# EasyEDA Pro project PBMCU_C_Hall.epro, board 整合板
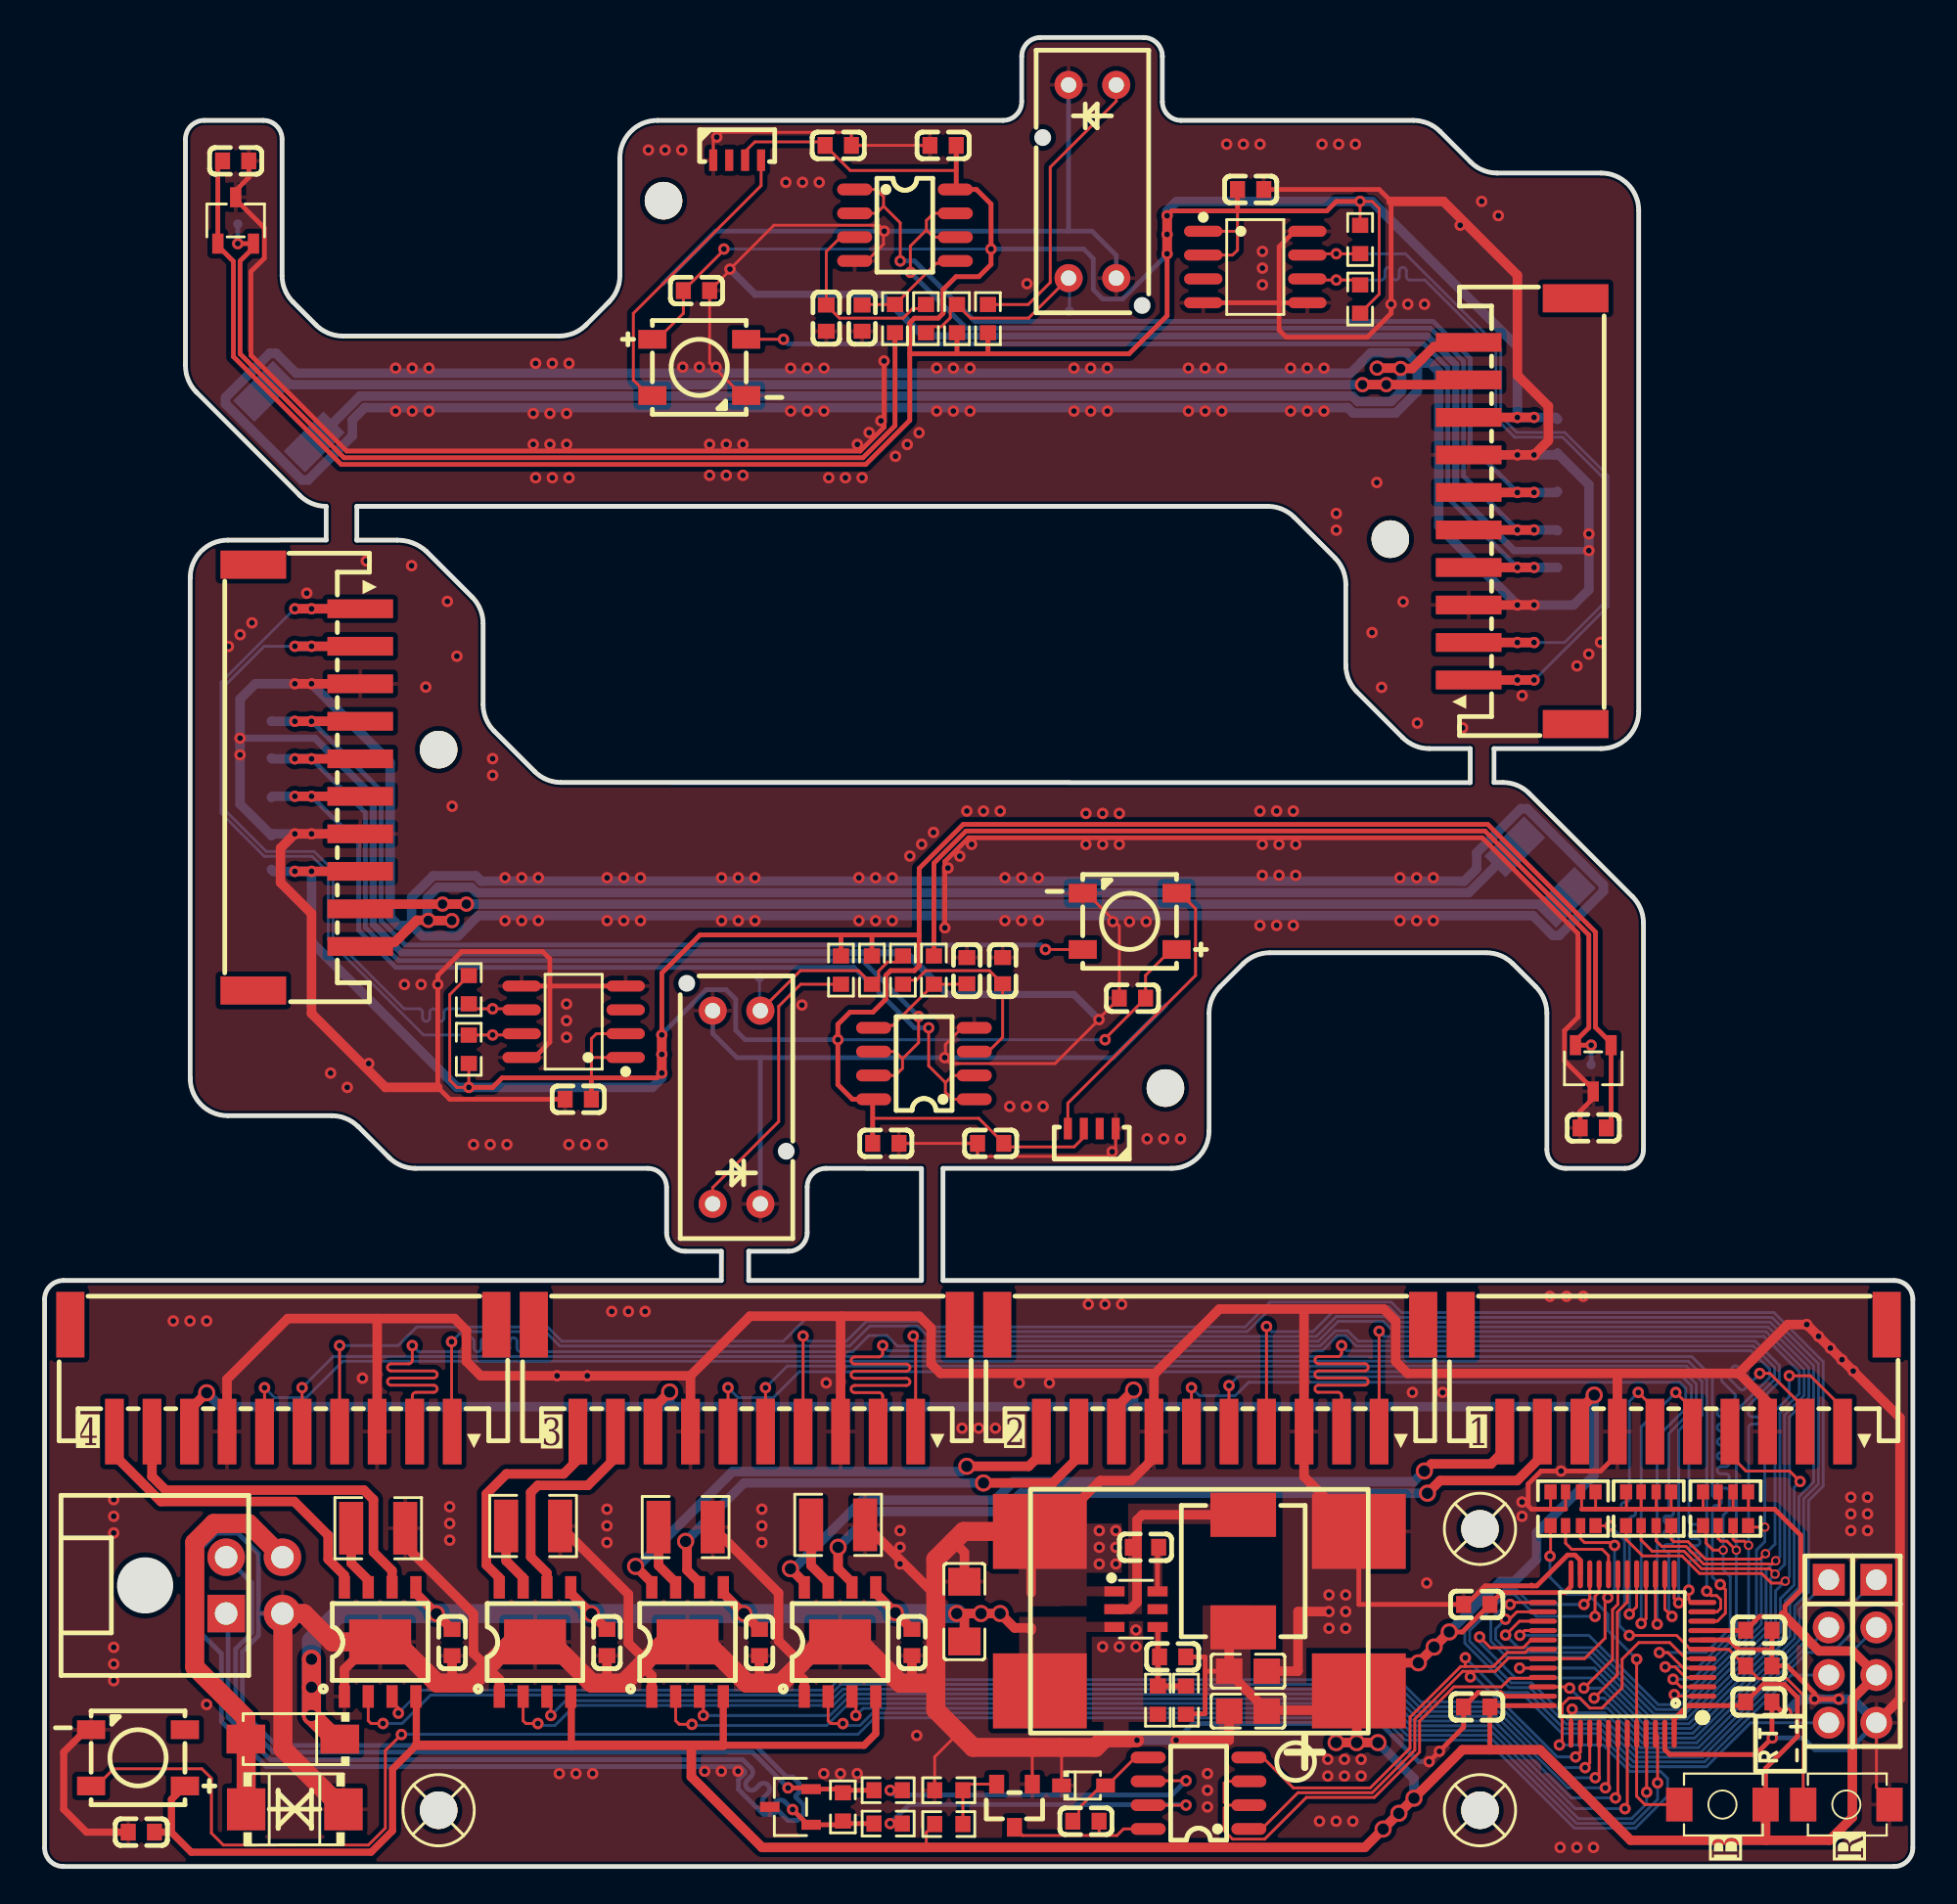
[diagram p4: board, top side]
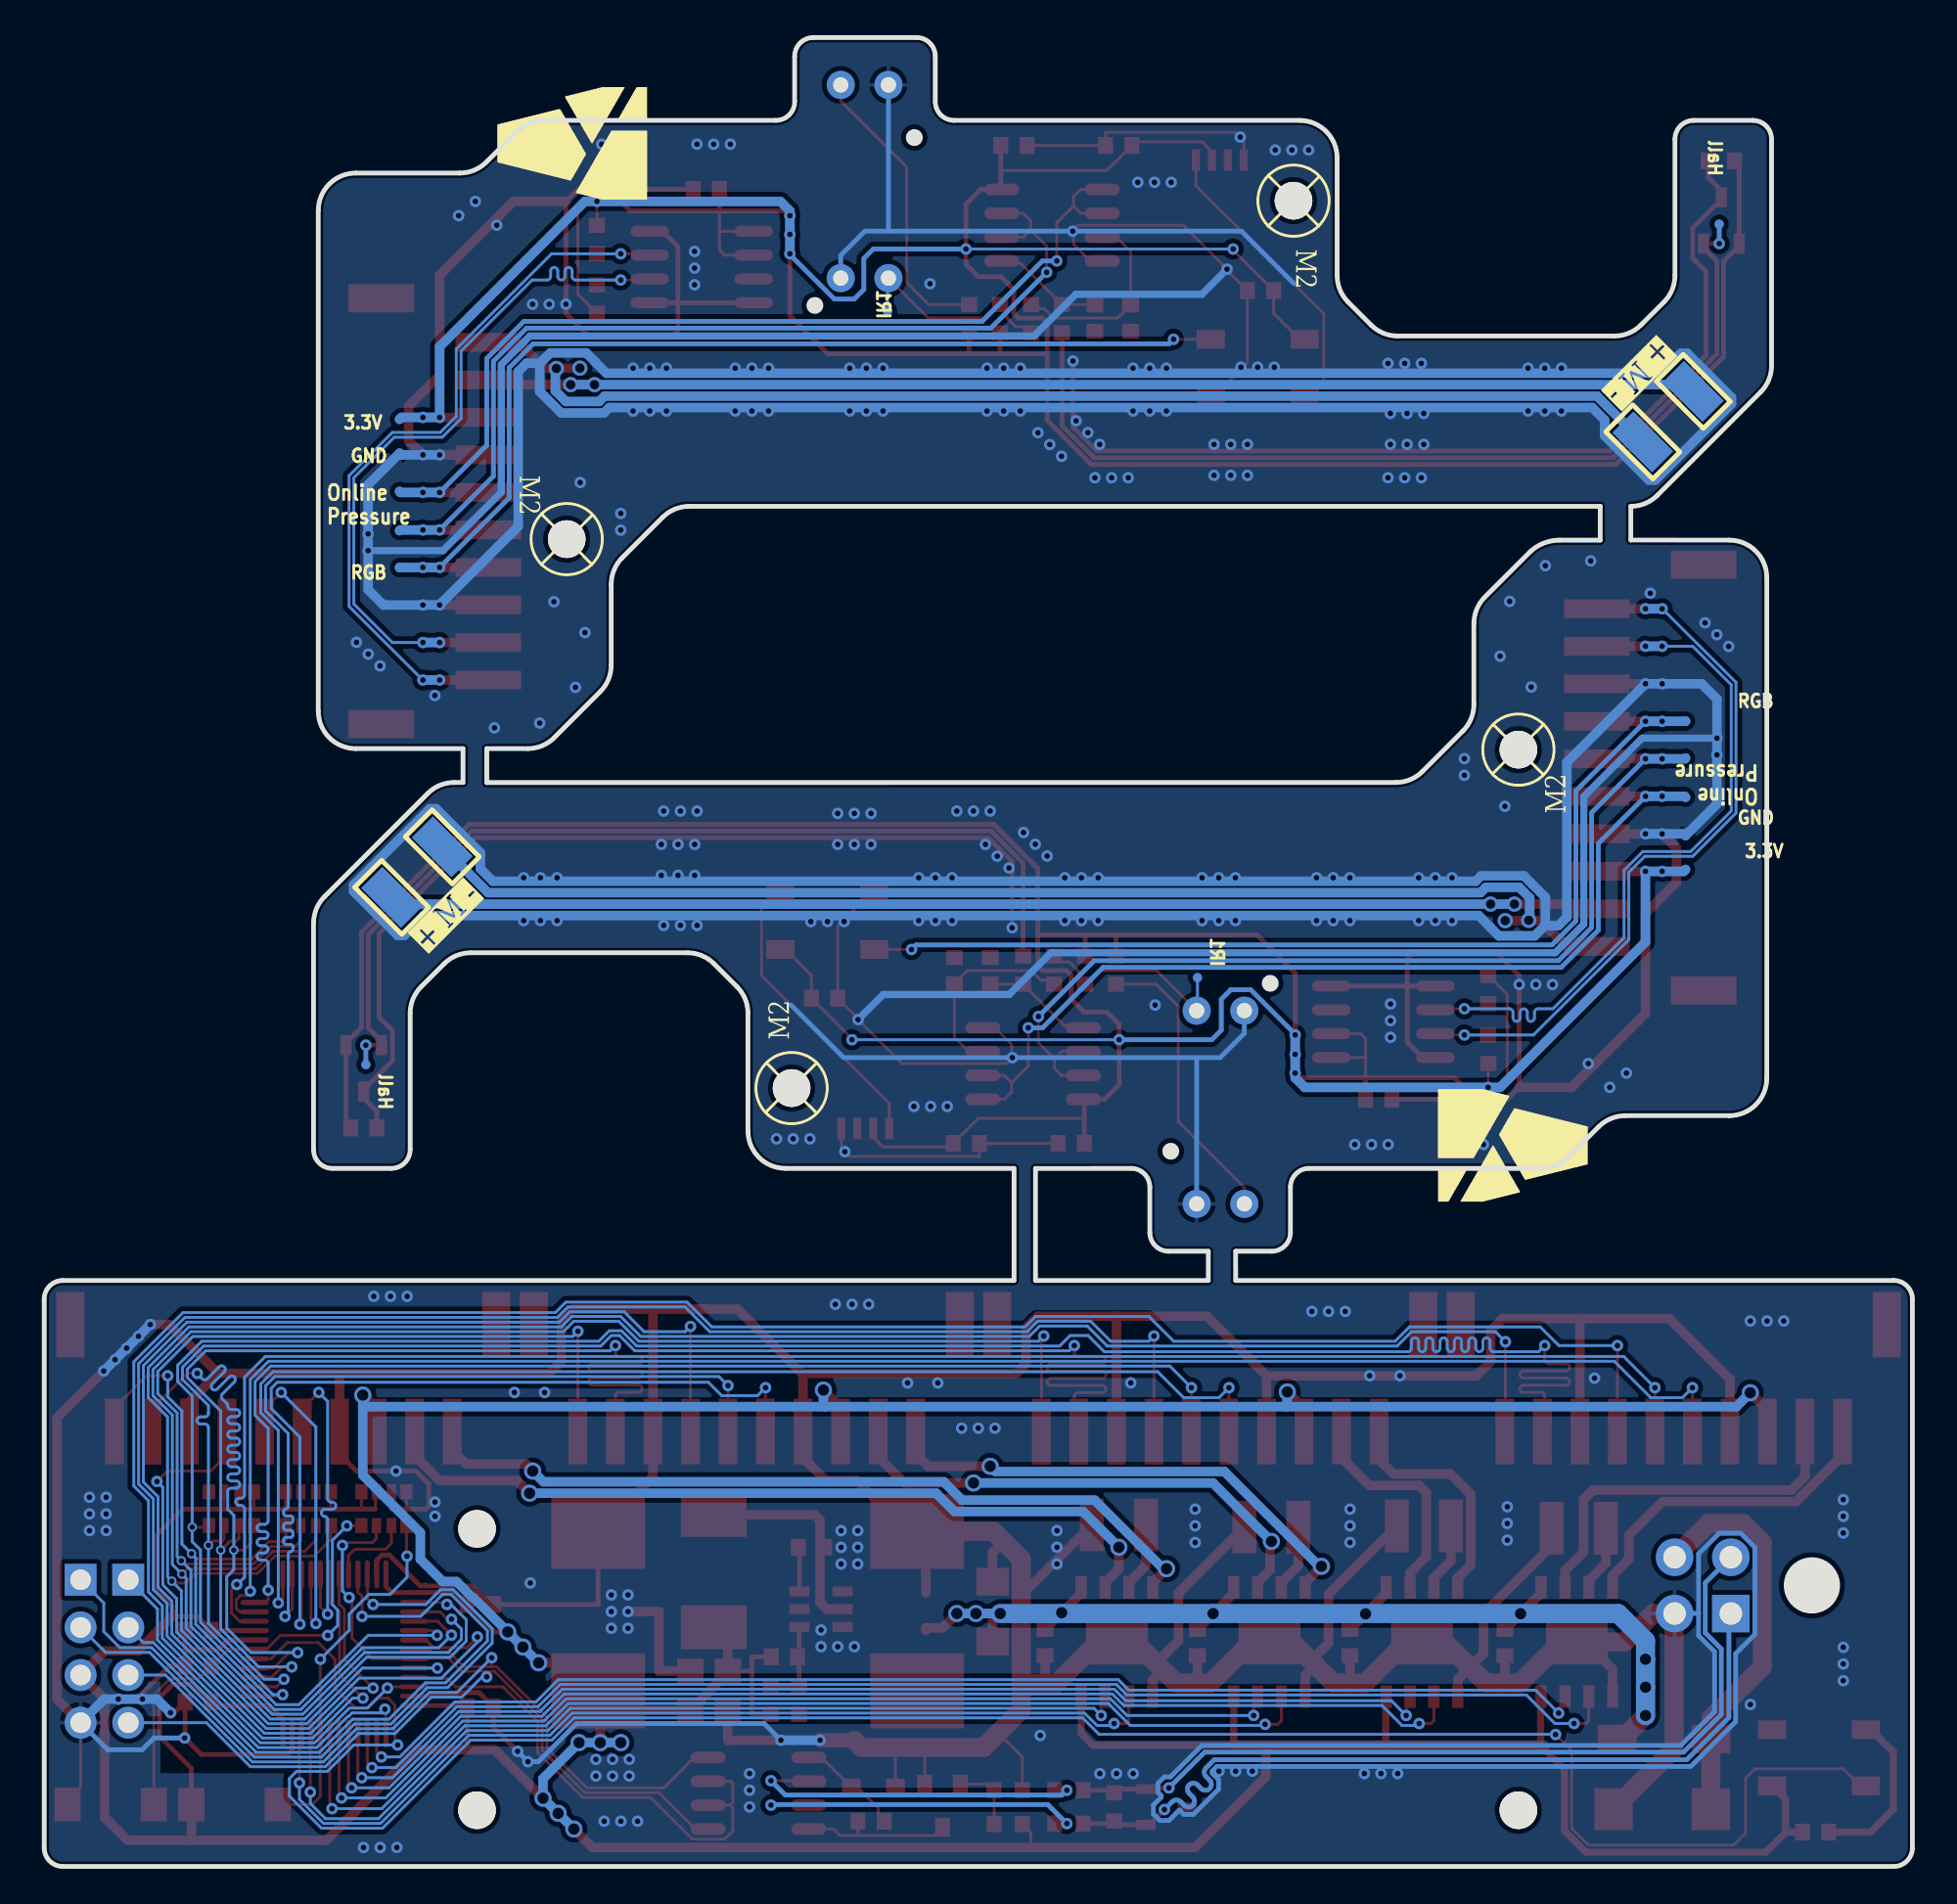
[diagram p5: board, bottom side, seen from below]

Outline 99.57 x 97.51 mm; copper layers: Top Layer, Bottom Layer. Coordinates in mm from the lower left corner of the outline.
Outline path: 0,30.24 arc(0.29,30.95) 1,31.24 36.07,31.24 36.07,32.8 34.15,32.8 arc(33.44,33.09) 33.15,33.8 33.15,36.22 arc(32.86,36.93) 32.15,37.22 19.77,37.22 arc(19,37.37) 18.35,37.8 16.72,39.44 arc(16.07,39.87) 15.3,40.03 9.76,40.03 arc(8.35,40.61) 7.76,42.03 7.76,68.71 arc(8.35,70.13) 9.76,70.71 15.01,70.72 15.01,72.51 arc(14.24,72.67) 13.59,73.1 8.09,78.6 arc(7.66,79.25) 7.51,80.02 7.51,92.09 arc(7.8,92.8) 8.51,93.09 11.66,93.09 arc(12.36,92.8) 12.66,92.09 12.66,84.82 arc(12.81,84.05) 13.24,83.4 14.47,82.18 arc(15.11,81.75) 15.88,81.59 27.44,81.59 arc(28.2,81.75) 28.85,82.18 30.07,83.4 arc(30.51,84.05) 30.66,84.82 30.66,91.09 arc(31.25,92.5) 32.66,93.09 51.08,93.09 arc(51.79,93.38) 52.08,94.09 52.08,96.51 arc(52.37,97.22) 53.08,97.51 58.57,97.51 arc(59.28,97.22) 59.57,96.51 59.57,94.09 arc(59.86,93.38) 60.57,93.09 72.95,93.09 arc(73.72,92.94) 74.37,92.5 76,90.87 arc(76.65,90.43) 77.42,90.28 82.96,90.28 arc(84.37,89.7) 84.96,88.28 84.96,61.6 arc(84.37,60.18) 82.96,59.6 77.25,59.6 77.25,57.79 77.71,57.79 arc(78.48,57.64) 79.13,57.21 84.63,51.71 arc(85.06,51.06) 85.21,50.29 85.21,38.22 arc(84.92,37.51) 84.21,37.22 81.06,37.22 arc(80.36,37.51) 80.06,38.22 80.06,45.49 arc(79.91,46.25) 79.48,46.9 78.25,48.13 arc(77.61,48.56) 76.84,48.71 65.28,48.71 arc(64.52,48.56) 63.87,48.13 62.65,46.9 arc(62.21,46.25) 62.06,45.49 62.06,39.22 arc(61.47,37.8) 60.06,37.22 47.88,37.22 47.88,31.24 98.57,31.24 arc(99.28,30.95) 99.57,30.24 99.57,1 arc(99.28,0.29) 98.57,0 1,0 arc(0.29,0.29) 0,1 0,30.24 ; 16.64,70.71 16.64,72.51 65.19,72.51 arc(65.96,72.36) 66.61,71.93 68.76,69.77 arc(69.2,69.12) 69.35,68.36 69.35,64.05 arc(69.5,63.28) 69.94,62.63 72.38,60.18 arc(73.03,59.75) 73.8,59.6 75.98,59.6 75.98,57.78 27.53,57.79 arc(26.76,57.95) 26.11,58.38 23.96,60.54 arc(23.52,61.18) 23.37,61.95 23.37,66.26 arc(23.22,67.03) 22.78,67.68 20.34,70.12 arc(19.62,70.56) 18.8,70.71 16.64,70.71 ; 37.52,32.8 39.64,32.8 arc(40.35,33.09) 40.64,33.8 40.64,36.22 arc(40.93,36.93) 41.64,37.22 46.74,37.21 46.74,31.24 37.52,31.24 37.52,32.8
Stack: Top Layer 0.035mm / Dielectric1 1.51mm FR4 er 4.5 / Bottom Layer 0.035mm

## Design rules (mm)
template: JLCPCB Capability(Two Layers Board)
spacing copperThickness1oz (default): track to track 0.102, other pairs 0.152 to 0.3
spacing copperThickness2oz: track to track 0.203, other pairs 0.152 to 0.3
track width copperThickness1oz (default): min 0.127, default 0.254, max 2.54
track width copperThickness2oz: min 0.203, default 0.254, max 2.54
differential pair differentialPair (default): width min 0.127, default 0.254, max 2.54; gap min 0.152, default 0.152
via viaSize (default): diameter min 0.5, default 0.61, max 10; hole min 0.3, default 0.305, max 6.3

## Placement (name value [footprint] x y rotation side)
3.3V  -  [Test-Point-0.5mm#2]  80.63 77.15 270 bottom
3.3V#2  -  [Test-Point-0.5mm#2]  12.09 53.15 90 bottom
C1  47pF  [C0603]  60.12 11.18 0 top
C2  22uF  [C1206]  49.02 13.59 270 top
C3  22uF  [C0805]  64.13 8.28 0 top
C4  22uF  [C0805]  64.13 10.41 180 top
C5  100nF  [C0603]  58.67 17.02 180 top
C6  -  [C0603]  64.28 89.41 180 top
C6#2  -  [C0603]  28.44 40.9 0 top
C6#3  -  [C0603]  91.36 10.69 180 top
C7  -  [C0603]  34.74 84.02 180 top
C7#2  -  [C0603]  57.98 46.29 0 top
C7#3  -  [C0603]  91.36 12.6 180 top
C8  -  [C0603]  47.89 91.76 0 top
C8#2  -  [C0603]  44.83 38.55 180 top
C8#3  -  [C0603]  91.36 8.77 180 top
C9  -  [C0603]  42.3 91.76 180 top
C9#2  -  [C0603]  50.42 38.55 0 top
C9#3  -  [C0603]  76.33 13.97 0 top
C10  -  [C0603]  10.18 90.93 180 top
C10#2  -  [C0603]  82.54 39.38 0 top
C10#3  -  [C0603]  76.33 8.51 0 top
C11  -  [C0603]  43.57 82.55 90 top
C11#2  -  [C0603]  49.15 47.76 270 top
C11#3  -  [C0603]  5.16 1.83 0 top
C12  -  [C0603]  41.66 82.55 90 top
C12#2  -  [C0603]  51.06 47.76 270 top
C13  100nF  [C0603]  21.72 11.94 90 top
C14  100nF  [C0603]  38.1 11.94 90 top
C15  100nF  [C0603]  29.97 11.94 90 top
C16  100nF  [C0603]  46.23 11.94 90 top
C17  100nF  [C0603]  55.5 2.41 0 top
CN1  HC-MX3.0-2*2AW  [CONN-TH_4P-P3.00_HC-MX3.0-2X2AW_1]  11.18 14.99 270 top
CN2  -  [CONN-SMD_10P-P2.00_2.0-10P-WT]  78.75 72.25 90 top
CN2#2  -  [CONN-SMD_10P-P2.00_2.0-10P-WT]  13.97 58.05 270 top
CN2#3  -  [CONN-SMD_10P-P2.00_2.0-10P-WT]  12.72 26.03 180 top
CN3  2.0-10P WT  [CONN-SMD_10P-P2.00_2.0-10P-WT]  37.42 26.03 180 top
CN4  2.0-10P WT  [CONN-SMD_10P-P2.00_2.0-10P-WT]  62.12 26.03 180 top
CN5  2.0-10P WT  [CONN-SMD_10P-P2.00_2.0-10P-WT]  86.82 26.03 180 top
D1  SMBJ24CA  [SMB_L4.6-W3.6-LS5.3-BI]  13.34 3.05 180 top
D2  PSM712-LF-T7  [SOT-23-3_L3.0-W1.7-P0.95-LS2.9-BR]  39.75 3.17 0 top
D3  1N5819WS  [SOD-323_L1.8-W1.3-LS2.5-RD]  55.37 4.32 0 top
D4  SS54  [SMA_L4.4-W2.8-LS5.4-R-RD]  13.23 6.79 180 top
GND  -  [Test-Point-0.5mm#2]  80.63 75.34 270 bottom
GND#2  -  [Test-Point-0.5mm#2]  12.09 54.97 90 bottom
H1  -  [HDR-TH_4P-P2.54-V-M]  97.63 11.48 270 top
H2  -  [HDR-TH_4P-P2.54-V-M]  95.09 11.48 270 top
Hall  -  [Test-Point-0.5mm]  10.3 87.56 270 top
Hall#2  -  [Test-Point-0.5mm]  82.42 42.75 90 top
IR1  -  [Test-Point-0.5mm]  38.1 47.39 270 top
IR1#2  -  [Test-Point-0.5mm]  54.62 82.92 90 top
L1  10uH  [IND-SMD_L7.3-W6.8]  63.88 15.75 270 top
LED1  -  [LED-SMD_4P-L5.0-W5.0-BL_XL-5050RGBC]  34.89 79.92 270 top
LED1#2  -  [LED-SMD_4P-L5.0-W5.0-BL_XL-5050RGBC]  57.83 50.39 90 top
LED1#3  -  [LED-SMD_4P-L5.0-W5.0-BL_XL-5050RGBC]  4.98 5.79 90 top
LED2  -  [LED-SMD_4P-L4.0-W1.7_XL-4020RGBC-WS2812B]  36.91 90.97 180 top
LED2#2  -  [LED-SMD_4P-L4.0-W1.7_XL-4020RGBC-WS2812B]  55.81 39.34 0 top
Online  -  [Test-Point-0.5mm#2]  80.63 73.31 270 bottom
Online#2  -  [Test-Point-0.5mm#2]  12.09 57 90 bottom
Pressure  -  [Test-Point-0.5mm#2]  80.63 71.22 180 bottom
Pressure#2  -  [Test-Point-0.5mm#2]  12.09 59.09 0 bottom
Q1  AO3401A  [SOT-23_L2.9-W1.3-P1.90-LS2.4-BR]  51.69 3.24 90 top
R1  -  [R0603]  50.28 82.52 90 top
R1#2  -  [R0603]  42.44 47.79 270 top
R1#3  -  [R0603]  60.83 8.86 270 top
R2  -  [R0603]  70.11 83.56 90 top
R2#2  -  [R0603]  22.61 46.74 270 top
R2#3  -  [R0603]  59.33 8.86 90 top
R3  -  [R0603]  70.11 86.74 270 top
R3#2  -  [R0603]  22.61 43.57 90 top
R3#3  -  [R1210]  17.78 18.03 0 top
R4  -  [R0603]  48.63 82.52 90 top
R4#2  -  [R0603]  44.09 47.79 270 top
R4#3  -  [R1210]  26.03 18.15 0 top
R5  -  [R0603]  45.32 82.52 90 top
R5#2  -  [R0603]  47.4 47.79 270 top
R5#3  -  [R1210]  34.16 18.09 0 top
R6  -  [R0603]  46.97 82.52 270 top
R6#2  -  [R0603]  45.75 47.79 90 top
R6#3  -  [R1210]  42.29 18.21 0 top
R7  10Ω  [R0603]  44.96 2.29 180 top
R8  10Ω  [R0603]  44.96 4.06 180 top
R9  120Ω  [R0603]  42.55 3.17 270 top
R10  470Ω  [R0603]  48.19 4.06 0 top
R11  10Ω  [R0603]  48.19 2.26 0 top
RGB  -  [Test-Point-0.5mm#2]  80.63 69.24 270 bottom
RGB#2  -  [Test-Point-0.5mm#2]  12.09 61.06 90 bottom
RN1  10kΩ  [RES-ARRAY-SMD_0603-8P-L3.2-W1.6-BL]  89.59 19.07 0 top
RN2  10kΩ  [RES-ARRAY-SMD_0603-8P-L3.2-W1.6-BL]  85.49 19.07 0 top
RN3  10kΩ  [RES-ARRAY-SMD_0603-8P-L3.2-W1.6-BL]  81.46 19.07 0 top
SW1  B3U-1000P  [KEY-SMD_B3U-1000PM]  96.01 3.3 0 top
SW2  B3U-1000P  [KEY-SMD_B3U-1000PM]  89.41 3.3 0 top
TP1  -  [M2螺丝]  21 3 90 top
TP1#2  -  [M2螺丝]  71.72 70.76 270 bottom
TP1#3  -  [M2螺丝]  21 59.54 90 bottom
TP2  -  [M2螺丝]  76.5 3 90 top
TP3  -  [M2螺丝]  76.5 18 90 top
TP5  -  [M2螺丝]  32.99 88.81 270 bottom
TP5#2  -  [M2螺丝]  59.74 41.5 90 bottom
U1  -  [SOIC-8_L4.9-W3.9-P1.27-LS6.0-BL]  64.52 85.27 270 top
U1#2  -  [SOIC-8_L4.9-W3.9-P1.27-LS6.0-BL]  28.2 45.03 90 top
U1#3  -  [SOT-23-6_L2.9-W1.6-P0.95-LS2.8-BL]  58.17 13.72 270 top
U2  CH32V203C8T6  [LQFP-48_L7.0-W7.0-P0.50-LS9.0-BL]  84.1 11.33 90 top
U3  -  [SMD 方焊盘 4*5]  70.04 9.36 270 top
U4  -  [SMD 方焊盘 4*5]  53.04 9.36 270 top
U4#2  -  [TEST-RING]  11.67 78.64 225 bottom
U4#3  -  [TEST-RING]  81.05 51.67 45 bottom
U5  -  [SMD 方焊盘 4*5]  53.04 17.86 90 top
U5#2  -  [TEST-RING]  14.37 75.95 225 bottom
U5#3  -  [TEST-RING]  78.35 54.36 45 bottom
U6  -  [SMD 方焊盘 4*5]  70.04 17.86 90 top
U7  -  [SOP-8_L4.9-W3.9-P1.27-LS6.0-BL]  61.5 3.91 90 top
U7#2  -  [OPTO-TH_4P_ITR9606]  55.84 89.83 270 top
U7#3  -  [OPTO-TH_4P_ITR9606]  36.88 40.48 90 top
U8  AT8236  [ESOP-8_L4.9-W3.9-P1.27-LS6.0-BL-EP]  17.88 11.97 0 top
U9  -  [ESOP-8_L4.9-W3.9-P1.27-LS6.0-BL-EP]  26.14 11.97 0 top
U9#2  -  [SOT-23-3_L2.9-W1.6-P1.90-LS2.8-BR]  10.18 87.75 270 top
U9#3  -  [SOT-23-3_L2.9-W1.6-P1.90-LS2.8-BR]  82.54 42.55 90 top
U10  -  [SOP-8_L4.9-W3.9-P1.27-LS6.0-BL]  45.85 87.5 270 top
U10#2  -  [SOP-8_L4.9-W3.9-P1.27-LS6.0-BL]  46.87 42.81 90 top
U10#3  -  [ESOP-8_L4.9-W3.9-P1.27-LS6.0-BL-EP]  34.27 11.97 0 top
U11  AT8236  [ESOP-8_L4.9-W3.9-P1.27-LS6.0-BL-EP]  42.39 11.97 0 top

## Footprints (pads in the part's own frame, mm; a bottom-side part is the same pattern mirrored in y, then rotated)
C0603
  rect 0.8x0.9 smd: 1(-0.7,0) 2(0.7,0)
C0805
  rect 1.41x1.35 smd: 1(-1,0) 2(1,0)
C1206
  rect 1.485x1.728 smd: 1(-1.593,0) 2(1.593,0)
CONN-SMD_10P-P2.00_2.0-10P-WT
  rect 1x3.5 smd: 1(-9,2.85) 2(-7,2.85) 3(-5,2.85) 4(-3,2.85) 5(-1,2.85) 6(1,2.85) 7(3,2.85) 8(5,2.85) 9(7,2.85) 10(9,2.85)
  rect 1.5x3.5 smd: 11(11.35,-2.85) 12(-11.35,-2.85)
CONN-TH_4P-P3.00_HC-MX3.0-2X2AW_1
  rect 2x2 hole 1.2: 1(1.5,-1.5)
  round 2 hole 1.2: 2(1.5,1.5) 3(-1.5,-1.5) 4(-1.5,1.5)
ESOP-8_L4.9-W3.9-P1.27-LS6.0-BL-EP
  rect 0.6x1.2 smd: 1(-1.905,-2.909) 2(-0.635,-2.909) 3(0.635,-2.909) 4(1.905,-2.909) 5(1.905,2.909) 6(0.635,2.909) 7(-0.635,2.909) 8(-1.905,2.909)
  rect 3.3x2.4 smd: 9(0,0)
HDR-TH_4P-P2.54-V-M
  rect 1.7x1.7 hole 1.1: 1(-3.81,0)
  round 1.7 hole 1.1: 2(-1.27,0) 3(1.27,0) 4(3.81,0)
IND-SMD_L7.3-W6.8
  rect 2.35x3.5 smd: 1(-3,0) 2(3,0)
KEY-SMD_B3U-1000PM
  rect 1.4x1.8 smd: 1(-2.286,0) 2(2.314,0)
LED-SMD_4P-L4.0-W1.7_XL-4020RGBC-WS2812B
  rect 0.43x1.15 smd: 1(1.275,0) 2(0.425,0) 3(-0.425,0) 4(-1.275,0)
LED-SMD_4P-L5.0-W5.0-BL_XL-5050RGBC
  rect 1x1.5 smd: 1(-1.5,-2.5) 2(1.5,-2.5) 3(1.5,2.5) 4(-1.5,2.5)
LQFP-48_L7.0-W7.0-P0.50-LS9.0-BL
  oval 0.27x1.5 smd: 1(-2.75,-4.25) 2(-2.25,-4.25) 3(-1.75,-4.25) 4(-1.25,-4.25) 5(-0.75,-4.25) 6(-0.25,-4.25) 7(0.25,-4.25) 8(0.75,-4.25) 9(1.25,-4.25) 10(1.75,-4.25) 11(2.25,-4.25) 12(2.75,-4.25) 25(2.75,4.25) 26(2.25,4.25) 27(1.75,4.25) 28(1.25,4.25) 29(0.75,4.25) 30(0.25,4.25) 31(-0.25,4.25) 32(-0.75,4.25) 33(-1.25,4.25) 34(-1.75,4.25) 35(-2.25,4.25) 36(-2.75,4.25)
  oval 1.5x0.27 smd: 13(4.25,-2.75) 14(4.25,-2.25) 15(4.25,-1.75) 16(4.25,-1.25) 17(4.25,-0.75) 18(4.25,-0.25) 19(4.25,0.25) 20(4.25,0.75) 21(4.25,1.25) 22(4.25,1.75) 23(4.25,2.25) 24(4.25,2.75) 37(-4.25,2.75) 38(-4.25,2.25) 39(-4.25,1.75) 40(-4.25,1.25) 41(-4.25,0.75) 42(-4.25,0.25) 43(-4.25,-0.25) 44(-4.25,-0.75) 45(-4.25,-1.25) 46(-4.25,-1.75) 47(-4.25,-2.25) 48(-4.25,-2.75)
M2螺丝
  round 2 hole 2: 1(0,0)
OPTO-TH_4P_ITR9606
  round 1.5 hole 0.818x0.813: 1(-5.15,1.27) 2(-5.15,-1.27) 3(5.15,-1.27) 4(5.15,1.27)
R0603
  rect 0.806x0.864 smd: 1(-0.753,0) 2(0.753,0)
R1210
  rect 1.282x2.808 smd: 1(-1.441,0) 2(1.441,0)
RES-ARRAY-SMD_0603-8P-L3.2-W1.6-BL
  rect 0.65x0.8 smd: 1(-1.2,-0.9) 4(1.2,-0.9) 5(1.2,0.9) 8(-1.2,0.9)
  rect 0.5x0.8 smd: 2(-0.4,-0.9) 3(0.4,-0.9) 6(0.4,0.9) 7(-0.4,0.9)
SMA_L4.4-W2.8-LS5.4-R-RD
  rect 2.062x1.539 smd: 1(2.503,0) 2(-2.503,0)
SMB_L4.6-W3.6-LS5.3-BI
  rect 2.047x2.241 smd: 1(-2.591,0) 2(2.591,0)
SMD 方焊盘 4*5
  rect 4x5 smd: 1(0,0)
SOD-323_L1.8-W1.3-LS2.5-RD
  rect 1x0.75 smd: 1(-1.173,0) 2(1.173,0)
SOIC-8_L4.9-W3.9-P1.27-LS6.0-BL
  oval 0.588x2.045 smd: 1(-1.905,-2.772) 2(-0.635,-2.772) 3(0.635,-2.772) 4(1.905,-2.772) 5(1.905,2.772) 6(0.635,2.772) 7(-0.635,2.772) 8(-1.905,2.772)
SOP-8_L4.9-W3.9-P1.27-LS6.0-BL
  oval 0.63x1.865 smd: 1(-1.905,-2.683) 2(-0.635,-2.683) 3(0.635,-2.683) 4(1.905,-2.683) 5(1.905,2.683) 6(0.635,2.683) 7(-0.635,2.683) 8(-1.905,2.683)
SOT-23-3_L2.9-W1.6-P1.90-LS2.8-BR
  rect 1.07x0.6 smd: 1(1.235,-0.95) 2(1.235,0.95) 3(-1.235,0)
SOT-23-3_L3.0-W1.7-P0.95-LS2.9-BR
  rect 1.038x0.532 smd: 1(1.101,-0.95) 2(1.101,0.95) 3(-1.101,0)
SOT-23-6_L2.9-W1.6-P0.95-LS2.8-BL
  rect 0.532x1.072 smd: 1(-0.95,-1.149) 2(0,-1.149) 3(0.95,-1.149) 4(0.95,1.149) 5(0,1.149) 6(-0.95,1.149)
SOT-23_L2.9-W1.3-P1.90-LS2.4-BR
  rect 1x0.8 smd: 1(1.15,-0.95) 2(1.15,0.95) 3(-1.15,0)
Test-Point-0.5mm
  round 0.5 smd far side: 1(0,0)
Test-Point-0.5mm#2
  round 0.5 smd: 1(0,0)
TEST-RING
  rect 3x1.6 smd: 1(0,0)

## Nets
3.3V: 3.3V.1 3.3V#2.1 C1.2 C3.2 C4.2 C6.2 C6#2.2 C7.2 C7#2.2 C7#3.2 C8.2 C8#2.2 C8#3.2 C9.2 C9#2.2 C9#3.2 C10.2 C10#2.2 C10#3.2 C11#3.2 CN2.8 CN2#2.8 CN2#3.8 CN3.8 CN4.8 CN5.8 H1.3 L1.2 LED1.1 LED1#2.1 LED1#3.1 LED2.3 LED2#2.3 R1.1 R1#2.1 R1#3.2 R2.1 R2#2.1 R3.1 R3#2.1 R4.1 R4#2.1 R11.1 RN1.5 RN1.6 RN1.7 RN1.8 RN2.5 RN2.6 RN2.7 RN2.8 RN3.5 RN3.6 SW2.2 U1.1 U1.2 U1#2.1 U1#2.2 U2.1 U2.9 U2.24 U2.36 U2.48 U3.1 U8.4 U9.4 U9#2.1 U9#3.1 U10.8 U10#2.8 U10#3.4 U11.4
24V: C2.2 C13.2 C14.2 C15.2 C16.2 D4.2 U1#3.3 U4.1 U8.5 U9.5 U10#3.5 U11.5
GND: C2.1 C3.1 C4.1 C6.1 C6#2.1 C6#3.1 C7.1 C7#2.1 C7#3.1 C8.1 C8#2.1 C8#3.1 C9.1 C9#2.1 C9#3.1 C10.1 C10#2.1 C10#3.1 C11.1 C11#2.1 C11#3.1 C12.1 C12#2.1 C13.1 C14.1 C15.1 C16.1 CN1.2 CN2.3 CN2.7 CN2#2.3 CN2#2.7 CN2#3.3 CN2#3.7 CN3.3 CN3.7 CN4.3 CN4.7 CN5.3 CN5.7 D1.1 D2.3 D3.1 GND.1 GND#2.1 H1.4 LED1.3 LED1#2.3 LED1#3.3 LED2.1 LED2#2.1 Q1.1 R2#3.1 R3#3.2 R4#3.2 R5#3.2 R6#3.2 R10.1 RN3.7 RN3.8 SW1.2 U1.4 U1.5 U1.8 U1#2.4 U1#2.5 U1#2.8 U1#3.1 U2.8 U2.23 U2.35 U2.47 U5.1 U6.1 U7#2.2 U7#2.4 U7#3.2 U7#3.4 U8.1 U8.9 U9.1 U9.9 U9#2.3 U9#3.3 U10.4 U10#2.4 U10#3.1 U10#3.9 U11.1 U11.9
BOOT0: RN3.1 SW2.1 U2.44
BOOT1: RN3.2 U2.20
EXIT_RX: H1.2 U2.22
EXIT_TX: H1.1 U2.21
HALL_OUT: Hall.1 Hall#2.1 R5.1 R5#2.1 U9#2.2 U9#3.2
HALL_RC: C11.2 C11#2.2 R5.2 R5#2.2 U10.5 U10#2.5
IR1_RC: C12.2 C12#2.2 R6.1 R6#2.1 U10.3 U10#2.3
IR1_RECV: IR1.1 IR1#2.1 R4.2 R4#2.2 R6.2 R6#2.2 U7#2.3 U7#3.3
K_ONLINE: CN2.6 CN2#2.6 Online.1 Online#2.1 U10.1 U10.2 U10#2.1 U10#2.2
K_ONLINE1: CN2#3.6 U2.11
K_ONLINE2: CN3.6 U2.13
K_ONLINE3: CN4.6 U2.15
K_ONLINE4: CN5.6 U2.17
K_PULL: CN2.5 CN2#2.5 Pressure.1 Pressure#2.1 U10.6 U10.7 U10#2.6 U10#2.7
K_PULL1: CN2#3.5 U2.10
K_PULL2: CN3.5 U2.12
K_PULL3: CN4.5 U2.14
K_PULL4: CN5.5 U2.16
MCU_RTS: U2.33 U7.2 U7.3
MCU_RX: H2.4 RN3.3 U2.31 U7.1
MCU_SCL: CN2.1 CN2#2.1 R3.2 R3#2.2 U1.7 U1#2.7
MCU_SCL1: CN2#3.1 RN2.1 U2.25
MCU_SCL2: CN3.1 RN2.2 U2.26
MCU_SCL3: CN4.1 RN2.3 U2.27
MCU_SCL4: CN5.1 RN2.4 U2.28
MCU_SDA: CN2.2 CN2#2.2 R2.2 R2#2.2 U1.6 U1#2.6
MCU_SDA1: CN2#3.2 RN1.4 U2.2
MCU_SDA2: CN3.2 RN1.3 U2.3
MCU_SDA3: CN4.2 RN1.2 U2.4
MCU_SDA4: CN5.2 RN1.1 U2.5
MCU_TX: H2.3 U2.30 U7.4
MOTOR1_H: U2.38 U8.3
MOTOR1_HOUT: CN2#3.9 U8.6
MOTOR1_L: U2.39 U8.2
MOTOR1_LOUT: CN2#3.10 U8.8
MOTOR2_H: U2.40 U9.3
MOTOR2_HOUT: CN3.9 U9.6
MOTOR2_L: U2.41 U9.2
MOTOR2_LOUT: CN3.10 U9.8
MOTOR3_H: U2.42 U10#3.3
MOTOR3_HOUT: CN4.9 U10#3.6
MOTOR3_L: U2.43 U10#3.2
MOTOR3_LOUT: CN4.10 U10#3.8
MOTOR4_H: U2.45 U11.3
MOTOR4_HOUT: CN5.9 U11.6
MOTOR4_L: U2.46 U11.2
MOTOR4_LOUT: CN5.10 U11.8
MOTOR_HOUT: CN2.9 CN2#2.9 U4#2.1 U4#3.1
MOTOR_LOUT: CN2.10 CN2#2.10 U5#2.1 U5#3.1
NRST: C6#3.2 RN3.4 SW1.1 U2.7
RGB_OUT: CN2.4 CN2#2.4 LED1.4 LED1#2.4 RGB.1 RGB#2.1
RGB_OUT1: CN2#3.4 U2.18
RGB_OUT2: CN3.4 U2.19
RGB_OUT3: CN4.4 U2.29
RGB_OUT4: CN5.4 U2.32
RS485_A: R8.1 U7.6
RS485_B: R7.1 U7.7
SWCLK: H2.2 U2.37
SWIO: H2.1 U2.34
SYS_RGB: LED1#3.4 U2.6
$1N1340: C17.1 D3.2 U7.5
$1N2752: C5.2 L1.1 U1#3.2
$1N2756: C5.1 U1#3.6
$1N6554: C1.1 R1#3.1 R2#3.2 U1#3.4
$1N10852: LED1.2 LED1#2.2 LED2.4 LED2#2.4
$1N13047: R1.2 R1#2.2 U7#2.1 U7#3.1
$1N17664: R3#3.1 U8.7
$1N17864: R4#3.1 U9.7
$1N18070: R5#3.1 U10#3.7
$1N18276: R6#3.1 U11.7
$1N22933: CN1.1 D2.1 R7.2 R9.2
$1N22936: CN1.3 D2.2 R8.2 R9.1
$1N32139: Q1.2 R10.2 R11.2
$1N32182: C17.2 Q1.3 U7.8
$1N32717: CN1.4 D1.2 D4.1

Pads without a net: CN2 11 12; CN2#2 11 12; CN2#3 11 12; CN3 11 12; CN4 11 12; CN5 11 12; LED1#3 2; LED2 2; LED2#2 2; TP1 1; TP1#2 1; TP1#3 1; TP2 1; TP3 1; TP5 1; TP5#2 1; U1 3; U1#2 3; U1#3 5

## Via types
v1: diameter 0.61, hole 0.305, Top Layer to Bottom Layer, 450 vias
v2: diameter 0.914, hole 0.61, Top Layer to Bottom Layer, 28 vias
v3: diameter 0.813, hole 0.508, Top Layer to Bottom Layer, 8 vias
v4: diameter 1.016, hole 0.61, Top Layer to Bottom Layer, 3 vias
v5: diameter 0.5, hole 0.3, Top Layer to Bottom Layer, 8 vias

## Routing (per net, layer and track width the routed paths; a pad name or vN(x,y) marks a point on that pad's centre or on a via; arc(x,y) is an arc through that point)
3.3V: length 739.2
  Top Layer w0.152: 29.14,43.13 29.14,42.04 ; 29.14,43.13 U1#2.1 ; 29.14,43.13 29.14,44.13 29.41,44.4 U1#2.2 ; 48.59,89.46 U10.8 ; RN1.6 89.99,19.05 89.99,19.05 ; RN3.6 81.91,19.92 81.91,19.05 ; R2#2.1 21.59,46.48 21.59,41.92 21.97,41.54 v1(22.61,41.54) 22.61,42.81 R3#2.1 ; 63.58,87.18 63.58,88.26 ; 63.58,87.18 U1.1 ; 63.58,87.18 63.58,86.17 63.31,85.91 U1.2 ; RN3.5 82.66,19.05 82.67,19.05 ; RN2.6 85.89,19.07 85.91,19.05 ; LED2.3 37.34,91.43 37.85,91.95 41.41,91.95 41.6,91.76 42.94,90.42 48.59,90.42 ; v1(56.52,44.08) 56.52,44.13 C7#2.2 58.68,47.51 60.06,48.89 LED1#2.1 ; RN2.5 86.69,19.07 86.67,19.05 ; 84.29,19.97 84.3,19.96 84.3,19.05 ; 90.81,19.05 90.81,19.96 90.79,19.97 ; LED2#2.3 55.38,38.88 54.87,38.36 51.31,38.36 49.78,39.89 44.13,39.89 ; 89.26,19.05 89.26,19.91 RN1.7 ; R3.1 70.11,87.5 v1(70.11,88.77) 70.75,88.77 71.13,88.39 71.13,83.83 R2.1 ; 91.72,1.4 91.73,1.4 ; 46.99,1.02 46.99,1.82 R11.1 ; RN1.8 88.39,19.05 88.39,19.05 ; v1(36.2,86.23) 36.2,86.17 C7.2 34.04,82.8 32.66,81.42 LED1.1 ; 44.13,40.85 U10#2.8 ; RN2.7 85.09,19.08 85.12,19.05
  Top Layer w0.254: 63.58,88.26 60.08,88.26 v1(59.82,88.01) ; 63.58,88.26 C6.2 ; 63.58,88.26 68.33,88.26 68.84,88.77 v1(70.11,88.77) ; R1.1 50.28,80.64 ; 50.28,80.64 57.79,80.64 59.82,82.67 v1(59.82,85.98) ; 50.28,80.64 48.63,80.64 ; C10.2 9.23,90.68 U9#2.1 9.23,86.4 10.06,85.57 10.06,80.49 15.81,74.75 43.76,74.75 46.11,77.1 46.11,80.64 ; U10#2.8 43.06,40.9 42.28,41.68 v1(42.28,44.08) 42.28,44.9 42.93,45.55 44.15,45.55 44.83,46.24 44.83,47.51 45.09,47.76 46.36,47.76 46.61,48.01 46.61,49.66 ; 60.9,11.18 61.85,11.18 61.85,8.14 60.83,8.14 ; R1#2.1 42.44,49.66 ; 42.44,49.66 34.93,49.66 32.9,47.63 v1(32.9,44.33) ; 42.44,49.66 44.09,49.66 ; C8#2.2 44.13,40.85 ; 29.14,42.04 32.64,42.04 v1(32.9,42.3) ; 29.14,42.04 C6#2.2 ; 29.14,42.04 24.39,42.04 23.88,41.54 v1(22.61,41.54) ; R4.1 48.63,80.64 ; 48.63,80.64 46.11,80.64 ; 46.11,80.64 46.11,82.29 46.36,82.55 47.63,82.55 47.89,82.8 47.89,84.07 48.57,84.76 49.79,84.76 50.44,85.41 v1(50.44,86.23) 50.44,88.63 49.66,89.41 U10.8 ; 48.59,89.46 C8.2 ; C4.2 61.85,10.41 ; 46.61,49.66 46.61,53.21 48.96,55.56 76.91,55.56 82.66,49.81 82.66,44.73 83.49,43.9 U9#3.1 83.49,39.63 C10#2.2 ; 46.61,49.66 44.09,49.66 ; SW2.2 91.72,5.23 93.42,6.93 93.42,9.02 92.73,9.71 91.6,9.71 C8#3.2 90.47,8.58 U2.1 87.57,8.58 86.85,7.86 U2.48 ; 44.09,49.66 R4#2.1 ; 81.91,19.05 92.2,19.05 93.6,17.65 93.6,14.73 92.76,13.89 92.76,13.33 91.39,13.33 C7#3.2 90.64,12.58 U2.9 ; U2.36 77.1,8.58 C10#3.2 77.03,6.23 77.04,6.22 ; v2(74.86,12.5) 75.56,12.5 C9#3.2 77.66,14.6 81.03,14.6 81.35,14.93 U2.24
  Top Layer w0.381: 28.07,6.46 28.07,9.03 U9.4 ; LED1#3.1 6.76,3.57 6.76,1.82 ; 6.76,1.82 7.81,0.76 17.4,0.76 18.54,1.91 18.54,5.19 19.81,6.46 19.81,9.04 U8.4 ; 6.76,1.82 6.74,1.83 C11#3.2 ; U11.4 44.3,7.09 43.67,6.46 36.17,6.46 36.17,6.46 U10#3.4
  Top Layer w0.508: 69.93,8.71 69.93,9.25 U3.1 ; 69.93,8.71 v2(69.93,6.6) ; 69.93,8.71 70.04,8.83 U3.1 ; 69.93,8.71 69.54,8.33 65.13,8.33 63.13,10.33 C4.2 63.13,12.75 L1.2 ; U3.1 71.54,10.86 v2(73.22,10.86) v2(74.05,11.7) v2(74.86,12.5) ; v1(59.82,85.98) v1(59.82,87.01) v1(59.82,88.01) ; 7.72,23.29 7.72,24.34 v2(8.64,25.26) ; v2(69.93,6.6) v2(71.06,6.6) ; v2(69.93,6.6) v2(68.83,6.6) ; v2(33.31,25.3) 32.42,24.41 CN3.8 ; CN2#2.8 v1(14.23,53.05) v1(13.34,53.05) ; v1(32.9,44.33) v1(32.9,43.29) v1(32.9,42.3) ; v2(82.59,25.13) 81.82,24.37 CN5.8 ; v1(79.38,77.25) v1(78.49,77.25) CN2.8 ; SW2.2 91.72,1.4 ; 34.47,6.46 19.81,6.46 ; 34.47,6.46 34.47,4.79 38.24,1.02 70.36,1.02 v2(71.34,1.99) v2(72.18,2.83) v2(72.98,3.64) 75.56,6.22 79.7,6.22 84.53,1.4 95.12,1.4 96.34,2.62 96.34,8.92 H1.3 96.34,11.49 94.57,11.49 93.83,12.23 93.83,12.25 92.67,13.42 ; 34.47,6.46 36.17,6.46 ; v2(58.04,25.4) 57.12,24.48 CN4.8
  Bottom Layer w0.152: v1(36.2,86.23) v1(50.44,86.23) ; v1(56.52,44.08) v1(42.28,44.08)
  Bottom Layer w0.254: v1(50.44,86.23) 55.38,86.23 55.89,85.72 55.89,84.07 56.4,83.56 57.45,83.56 59.82,85.94 ; 32.9,44.37 35.27,46.74 36.32,46.74 36.83,46.24 36.83,44.58 37.34,44.08 v1(42.28,44.08)
  Bottom Layer w0.508: 33.33,24.51 33.33,25.29 v2(33.31,25.3) ; 33.33,24.51 57.98,24.51 ; 33.33,24.51 9.38,24.51 v2(8.64,25.26) ; 3.3V.1 80.53,77.25 v1(79.38,77.25) v1(78.49,77.25) 78.49,81.02 70.75,88.77 v1(70.11,88.77) 60.33,88.77 59.82,88.26 v1(59.82,88.01) v1(59.82,87.01) v1(59.82,85.98) ; 57.98,24.51 58.04,24.57 v2(58.04,25.4) ; 57.98,24.51 82.59,24.51 ; 82.59,24.51 82.59,20.86 79.52,17.8 79.52,16.38 78.33,15.19 77.59,15.19 76.75,14.35 76.71,14.35 v2(74.86,12.5) v2(74.05,11.7) v2(73.22,10.86) ; 82.59,24.51 v2(82.59,25.13) ; v2(68.83,6.6) v2(69.93,6.6) v2(71.06,6.6) 72.98,4.68 v2(72.98,3.64) v2(72.18,2.83) v2(71.34,1.99) ; 3.3V#2.1 12.19,53.05 v1(13.34,53.05) v1(14.23,53.05) 14.23,49.28 21.97,41.54 v1(22.61,41.54) 32.39,41.54 32.9,42.04 v1(32.9,42.3) v1(32.9,43.29) v1(32.9,44.33)
24V: length 64.4
  Top Layer w0.508: C13.2 v2(20.88,13.47) 19.79,14.57 19.79,14.88 ; U9.5 28.04,14.57 v2(29.14,13.47) C15.2 ; U10#3.5 36.17,14.57 C14.2 ; 49.02,13.49 v2(49.91,13.49) v2(50.93,13.49) 51.69,12.72 52.58,12.72 52.58,12.59 ; 49.02,13.49 C2.2 ; 49.02,13.49 v2(48.62,13.49) ; U11.5 44.3,14.57 v2(45.34,13.53) C16.2
  Top Layer w1.016: v4(14.22,11.05) v4(14.22,9.56) v4(14.22,8.05) 15.48,6.79 D4.2
  Bottom Layer w0.508: v2(50.93,13.49) v2(49.91,13.49) v2(48.62,13.49)
  Bottom Layer w1.016: v4(14.22,8.05) v4(14.22,9.56) v4(14.22,11.05) 14.22,12.03 15.68,13.49 v2(37.27,13.49) v2(48.62,13.49)
GND: length 1314.5
  Top Layer w0.152: 80.26,19.05 RN3.8 ; H1.4 97.63,4.23 98.33,3.53 SW1.2 ; 52.66,6.35 52.64,6.33 Q1.1 ; LED2.1 35.64,92.01 36.08,92.45 43,92.45 C9.1 C8.1 ; U10.4 43.82,85.6 44.71,86.48 44.71,87.25 44.46,87.5 38.87,87.5 v1(36.53,85.16) 36.53,85.1 C7.1 35.44,80.16 37.18,78.42 LED1.3 ; LED2#2.1 57.08,38.29 56.64,37.85 49.72,37.85 C9#2.1 45.53,38.55 ; 48.71,7.12 47.44,5.84 R10.1 ; 54.18,6.35 54.2,6.33 D3.1 ; RN3.7 81.06,19.05 ; LED1#2.3 55.54,51.89 57.28,50.15 C7#2.1 56.19,45.21 v1(56.19,45.15) 53.85,42.81 48.26,42.81 48.01,43.06 48.01,43.82 48.9,44.71 U10#2.4
  Top Layer w0.254: 65.79,83.37 65.79,86.36 66.61,87.18 U1.8 ; 65.79,83.37 U1.4 ; 65.79,83.37 65.79,81.91 66.18,81.53 70.49,81.53 71.76,82.8 v1(71.76,83.29) 71.76,88.77 71.13,89.41 C6.1 ; 65.79,83.37 U1.5 ; 92.06,11.56 90.3,11.56 89.78,12.08 U2.8 ; 92.06,11.56 C6#3.1 92.88,10.69 94.33,9.24 v1(94.33,8.92) v1(95.62,8.92) ; 92.06,11.56 C7#3.1 ; v1(44.74,80.26) 44.74,76.73 43.47,75.46 16.1,75.46 11,80.57 11,85.03 11.71,85.74 11.71,87.35 10.18,88.88 U9#2.3 10.18,89.35 10.88,90.05 C10.1 ; U2.23 81.85,16.32 81.56,16.61 81.17,16.61 79.53,14.96 79.29,14.96 ; 26.93,46.94 U1#2.4 ; 26.93,46.94 26.93,48.39 26.55,48.78 22.23,48.78 20.96,47.51 v1(20.96,47.02) 20.96,41.54 21.59,40.9 C6#2.1 ; 26.93,46.94 26.93,43.95 26.11,43.13 U1#2.8 ; 26.93,46.94 U1#2.5 ; C10#2.1 81.84,40.26 82.54,40.96 U9#3.3 82.54,41.43 81.01,42.95 81.01,44.56 81.72,45.28 81.72,49.74 76.62,54.85 49.25,54.85 47.98,53.57 v1(47.98,50.05) ; 81.06,19.05 79.25,19.05 79.07,19.23 79.07,20.39 79.76,21.08 v1(80.82,21.08) 82.93,21.08 83.82,21.97 CN5.7 ; 79.29,14.96 79.25,15.01 ; 79.29,14.96 76.77,14.96 75.78,13.97 C9#3.1 70.04,13.97 U6.1 ; v1(73.79,5.59) v1(74.34,6.14) 75.63,7.43 C10#3.1 76.39,9.27 77.6,9.27 77.79,9.08 U2.35 ; v1(92.84,8.2) 92.63,8.2 C8#3.1 92.06,6.84 91.19,5.97 86.61,5.97 86.35,6.23 U2.47
  Top Layer w0.381: C11#3.1 2.23,1.83 1.02,3.05 1.02,6.1 2.21,7.29 LED1#3.3
  Top Layer w0.508: 17.77,29.21 12.95,29.21 9.72,25.98 CN2#3.7 ; 17.77,29.21 17.72,29.17 CN2#3.3 ; 17.77,29.21 21.84,29.21 22.48,28.57 22.48,26.92 23.24,26.16 v1(27.31,26.16) v1(28.92,26.16) 34.42,26.16 ; 90.3,26.29 91.82,24.76 CN5.3 ; 90.3,26.29 83.79,26.29 ; 90.3,26.29 92.9,28.89 v1(93.92,28.89) v1(94.55,28.26) v1(95.18,27.63) v1(95.79,27.02) v1(96.39,26.42) 98.88,23.92 98.88,8.92 H1.4 ; 83.79,26.29 72.64,26.29 72.01,26.92 72.01,29.08 71.37,29.72 67.1,29.72 ; 83.79,26.29 83.82,26.25 CN5.7 ; CN3.7 34.42,26.16 ; 34.42,26.16 34.42,26.17 37.59,29.34 42.5,29.34 ; 48.44,17.32 49.02,16.74 C2.1 ; 63.13,8.33 63.13,6.73 v1(60.31,6.73) ; 38.12,9.77 38.1,9.79 38.1,11.24 ; 59.18,26.29 62.61,29.72 67.1,29.72 ; 59.18,26.29 47.75,26.29 47.24,26.8 47.24,28.7 46.61,29.34 42.5,29.34 ; 59.18,26.29 59.12,26.23 CN4.7 59.12,21.78 57.91,20.57 56.26,20.57 53.55,17.86 U5.1 52.58,17.4 52.58,14.59 ; C13.1 21.72,9.87 21.8,9.78 ; U10#3.1 32.36,10.18 31.81,10.73 ; CN2.3 v1(78.49,67.25) v1(79.38,67.25) ; 40.31,10.84 39.12,12.03 39.12,14.58 R5#3.2 ; U6.1 67.12,20.78 CN4.3 67.12,29.7 67.1,29.72 ; CN2#2.7 v1(14.23,55.05) v1(13.34,55.05) 12.58,54.29 12.58,52.46 14.23,50.81 14.23,45.47 18.16,41.54 20.96,41.54 ; 42.5,29.34 42.42,29.26 CN3.3 ; CN2#2.3 v1(14.23,63.05) v1(13.34,63.05) ; U9.1 24.23,9.98 22.86,11.35 22.86,13.46 19.22,17.1 R3#3.2 ; 17.43,11.97 15.98,10.52 U8.1 ; R4#3.2 31.12,14.51 31.12,11.91 32.05,10.97 ; C15.1 29.97,9.78 ; 40.13,10.29 40.49,9.93 U11.1 ; C4.1 66.8,10.41 66.8,13.59 v1(68.45,13.59) ; 46.27,9.77 46.23,9.81 C16.1 ; R6#3.2 47.5,14.45 ; 71.76,88.77 74.56,88.77 78.49,84.83 78.49,79.5 80.15,77.85 80.15,76.02 v1(79.38,75.25) v1(78.49,75.25) CN2.7
  Top Layer w0.762: 56.39,6.73 v1(58.22,6.73)
  Top Layer w1.016: U5.1 48.98,17.86 47.5,16.38 47.5,9.77 ; D1.1 12.7,6.27 12.7,13.46 CN1.2 13.82,13.49 15.33,11.97 U8.9 18.71,11.97 20.91,9.78 22.73,9.78 24.92,11.97 U9.9 26.97,11.97 29.16,9.78 30.86,9.78 33.05,11.97 35.22,11.97 37.42,9.77 39.24,9.77 41.43,11.97 43.41,11.97 45.6,9.77 47.5,9.77 ; 47.5,9.77 47.5,8.34 48.71,7.12 49.48,6.35 56.01,6.35 56.39,6.73
  Bottom Layer w0.254: 59.75,45.92 56.96,43.12 v1(47.97,43.12) 38.15,43.12 ; 38.15,43.12 36.9,43.12 35.61,44.41 U7#3.4 ; 38.15,43.12 U7#3.2 ; 11.4,13.49 12.67,13.49 CN1.2 ; 11.4,13.49 11.4,16.67 10.3,17.76 9.15,17.76 8.4,17.02 8.4,12.37 9.42,11.34 9.42,7.72 11.81,5.33 37.06,5.33 37.31,5.09 37.31,4.96 36.98,4.63 36.98,4.12 38.32,2.78 38.83,2.78 39.04,2.99 39.08,2.99 39.62,2.45 40.11,2.45 40.45,2.79 40.45,3.28 40.04,3.69 40.04,3.78 40.21,3.95 40.21,4.43 39.87,4.77 39.54,4.77 37.87,6.45 12.34,6.45 10.54,8.25 10.54,11.45 11.4,12.31 11.4,13.49 ; 54.57,87.18 55.82,87.18 57.11,85.89 U7#2.4 ; 54.57,87.18 v1(44.75,87.18) 35.76,87.18 32.97,84.39 ; 54.57,87.18 U7#2.2 ; 93.72,6.85 94.35,6.22 96.18,6.22 H1.4 ; 93.72,6.85 v1(92.08,6.85) ; 93.72,6.85 93.73,6.86 ; v1(60.31,6.73) 61.19,7.62 71.2,7.62 73.23,5.59 v1(73.79,5.59) v1(74.34,6.14)
  Bottom Layer w0.381: v1(36.53,85.16) 37.87,83.82 44.59,83.82 46.81,81.6 73.68,81.6 75.21,80.07 75.21,73.26 78.32,70.15 v1(82.3,70.15) ; v1(56.19,45.15) 54.85,46.49 48.13,46.49 45.91,48.71 19.04,48.71 17.51,50.23 17.51,57.04 14.4,60.15 v1(10.42,60.15)
  Bottom Layer w0.508: v1(14.23,55.05) v1(13.34,55.05) 12.18,55.05 GND#2.1 10.42,56.64 v1(10.42,59.27) v1(10.42,60.15) 10.42,62.24 11.23,63.05 v1(13.34,63.05) v1(14.23,63.05) 18.42,58.86 18.42,50.61 18.86,50.16 19.58,50.16 ; v1(58.22,6.73) v1(60.31,6.73) ; 73.14,80.15 73.16,80.12 73.16,78.64 72.01,77.49 69.73,77.49 69.45,77.78 17.06,77.78 16.4,77.12 16.4,76.27 14.04,73.91 13.7,73.91 9.64,77.98 9.64,78.31 12,80.67 12.34,80.67 13.4,79.61 69.6,79.61 70.21,80.21 70.21,80.22 70.68,80.69 72.59,80.69 73.14,80.15 ; 73.14,80.15 73.85,80.15 74.3,79.7 74.3,71.45 v1(78.49,67.25) v1(79.38,67.25) 81.49,67.25 82.3,68.07 v1(82.3,70.15) v1(82.3,71.04) 82.3,73.66 GND.1 80.54,75.25 v1(79.38,75.25) v1(78.49,75.25) ; 19.58,50.16 20.13,49.61 22.04,49.61 22.51,50.09 22.51,50.1 23.12,50.7 79.32,50.7 80.38,49.63 80.72,49.63 83.08,51.99 83.08,52.33 79.02,56.39 78.68,56.39 76.32,54.03 76.32,53.19 75.66,52.53 23.27,52.53 22.98,52.81 20.71,52.81 19.56,51.67 19.56,50.18 19.58,50.16 ; v1(96.39,26.42) v1(95.79,27.02) v1(95.18,27.63) v1(94.55,28.26) v1(93.92,28.89) ; H1.4 96.37,8.92 v1(95.62,8.92) v1(94.33,8.92) 93.56,8.92 v1(92.84,8.2)
  vias: v1(3.68,19.56) v1(3.68,18.67) v1(3.68,17.78) v1(3.68,11.68) v1(3.68,10.79) v1(3.68,9.91) v1(6.86,29.08) v1(7.75,29.08) v1(8.64,29.08) v1(8.64,8.64) v1(9.79,65.04) v1(10.42,65.67) v1(11.05,66.3) v1(13.97,67.88) v1(15.24,42.3) v1(16.13,41.54) v1(16.94,26.03) v1(17.15,69.6) v1(17.27,42.81) v1(18.71,79.88) v1(18.71,77.59) v1(19.18,47.02) v1(19.6,79.88) v1(19.6,77.59) v1(19.56,69.35) v1(20.07,47.02) v1(20.32,62.88) v1(20.48,79.88) v1(20.48,77.59) v1(21.47,67.44) v1(21.59,19.18) v1(21.59,18.29) v1(21.59,17.4) v1(21.72,56.52) v1(21.97,64.52) v1(22.86,38.49) v1(23.75,38.49) v1(23.88,59.06) v1(23.88,58.17) v1(24.54,52.71) v1(24.54,50.43) v1(24.64,38.49) v1(25.43,52.71) v1(25.43,50.43) v1(26.04,77.47) v1(26.04,75.82) v1(26.17,80.13) v1(26.17,74.04) v1(26.31,52.71) v1(26.31,50.43) v1(26.93,77.47) v1(26.93,75.82) v1(27.06,80.13) v1(27.06,74.04) v1(27.43,4.95) v1(27.81,45.98) v1(27.81,45.09) v1(27.81,44.2) v1(27.82,77.47) v1(27.82,75.82) v1(27.95,80.13) v1(27.95,74.04) v1(27.94,38.49) v1(28.32,4.95) v1(28.83,38.49) v1(29.21,4.95) v1(29.72,38.49) v1(29.98,52.71) v1(29.98,50.43) v1(29.97,19.05) v1(29.97,18.16) v1(29.97,17.27) v1(30.23,29.59) v1(30.87,52.71) v1(30.87,50.43) v1(31.12,29.59) v1(31.76,52.71) v1(31.76,50.43) v1(32,29.59) v1(32.18,91.51) v1(33.07,91.51) v1(33.96,91.51) v1(34.01,79.93) v1(34.9,79.93) v1(35.18,5.08) v1(35.44,75.82) v1(35.44,74.17) v1(35.79,79.93) v1(35.82,92.2) v1(36.08,52.71) v1(36.08,50.43) v1(36.07,5.08) v1(36.33,75.82) v1(36.33,74.17) v1(36.97,52.71) v1(36.97,50.43) v1(36.96,5.08) v1(37.22,75.82) v1(37.22,74.17) v1(37.86,52.71) v1(37.86,50.43) v1(38.23,19.05) v1(38.23,18.16) v1(38.23,17.27) v1(39.5,89.79) v1(39.76,79.88) v1(39.76,77.59) v1(40.39,89.79) v1(40.36,45.93) v1(40.65,79.88) v1(40.65,77.59) v1(41.28,89.79) v1(41.54,79.88) v1(41.54,77.59) v1(41.53,4.95) v1(41.66,25.78) v1(41.79,74.04) v1(42.42,4.95) v1(42.68,74.04) v1(43.31,75.82) v1(43.31,4.95) v1(43.4,52.71) v1(43.4,50.43) v1(43.57,74.04) v1(43.94,76.45) v1(44.29,52.71) v1(44.29,50.43) v1(44.57,77.07) v1(45.18,52.71) v1(45.18,50.43) v1(45.35,75.18) v1(45.59,17.91) v1(45.59,17.02) v1(45.59,16.13) v1(45.98,75.81) v1(46.12,53.87) v1(46.48,6.98) v1(46.6,76.44) v1(46.74,54.5) v1(47.37,55.13) v1(47.54,79.88) v1(47.54,77.59) v1(48.15,53.23) v1(48.43,79.88) v1(48.43,77.59) v1(48.78,53.86) v1(48.9,23.37) v1(49.15,56.27) v1(49.32,79.88) v1(49.32,77.59) v1(49.41,54.49) v1(49.78,23.37) v1(50.04,56.27) v1(50.67,23.37) v1(50.93,56.27) v1(51.18,52.71) v1(51.18,50.43) v1(51.44,40.52) v1(51.94,25.78) v1(52.07,52.71) v1(52.07,50.43) v1(52.36,84.38) v1(52.33,40.52) v1(52.96,52.71) v1(52.96,50.43) v1(53.22,40.52) v1(53.55,25.78) v1(54.86,79.88) v1(54.86,77.59) v1(55.5,56.14) v1(55.5,54.49) v1(55.63,29.97) v1(55.75,79.88) v1(55.75,77.59) v1(56.21,17.9) v1(56.21,17.02) v1(56.21,16.13) v1(56.39,56.14) v1(56.39,54.49) v1(56.39,11.72) v1(56.52,29.97) v1(56.64,79.88) v1(56.64,77.59) v1(56.9,38.11) v1(56.93,50.37) v1(57.1,17.9) v1(57.1,17.02) v1(57.1,16.13) v1(57.28,56.14) v1(57.28,54.49) v1(57.28,11.72) v1(57.4,29.97) v1(57.82,50.37) v1(58.17,12.61) v1(58.17,11.72) v1(58.71,50.37) v1(58.76,38.8) v1(59.65,38.8) v1(60.54,38.8) v1(60.96,79.88) v1(60.96,77.59) v1(61.85,79.88) v1(61.85,77.59) v1(61.98,4.95) v1(61.98,4.06) v1(61.98,3.17) v1(62.74,79.88) v1(62.74,77.59) v1(63,91.82) v1(63.89,91.82) v1(64.78,91.82) v1(64.77,56.27) v1(64.77,50.17) v1(64.91,86.1) v1(64.91,85.21) v1(64.91,84.33) v1(64.9,54.49) v1(64.9,52.84) v1(65.66,56.27) v1(65.66,50.17) v1(65.79,54.49) v1(65.79,52.84) v1(66.41,79.88) v1(66.41,77.59) v1(66.55,56.27) v1(66.55,50.17) v1(66.68,54.49) v1(66.68,52.84) v1(67.29,79.88) v1(67.29,77.59) v1(67.94,2.41) v1(68.08,91.82) v1(68.18,79.88) v1(68.18,77.59) v1(68.39,5.71) v1(68.39,4.82) v1(68.45,14.48) v1(68.45,12.7) v1(68.84,72.13) v1(68.84,71.24) v1(68.83,2.41) v1(68.97,91.82) v1(69.28,5.71) v1(69.28,4.82) v1(69.34,14.48) v1(69.34,13.59) v1(69.34,12.7) v1(69.72,2.41) v1(69.86,91.82) v1(70.16,5.71) v1(70.16,4.82) v1(70.75,65.78) v1(71,73.78) v1(71.25,62.86) v1(72.24,52.71) v1(72.24,50.43) v1(72.4,67.43) v1(72.65,83.29) v1(72.9,25.27) v1(73.16,60.96) v1(73.12,52.71) v1(73.12,50.43) v1(73.54,83.29) v1(73.66,15.11) v1(74.01,52.71) v1(74.01,50.43) v1(74.51,25.27) v1(75.45,87.5) v1(75.57,60.7) v1(76.59,88.77) v1(77.48,88.01) v1(78.75,62.43) v1(78.74,19.43) v1(78.74,18.67) v1(80.22,30.39) v1(80.77,1.02) v1(81.11,30.39) v1(81.67,64.01) v1(81.66,1.02) v1(82,30.39) v1(82.3,64.63) v1(82.55,1.02) v1(82.93,65.26) v1(96.27,19.69) v1(96.27,18.8) v1(96.27,17.91) v1(97.16,19.69) v1(97.16,18.8) v1(97.16,17.91)
BOOT0: length 19.5
  Top Layer w0.152: SW2.1 85.29,3.3 84.85,3.74 U2.44 v1(84.85,11.05) ; RN3.1 80.26,16.57 v1(80.23,16.54)
  Bottom Layer w0.152: v1(84.85,11.05) 83.31,12.59 83.31,13.45 82.26,14.5 81.14,14.5 80.23,15.41 v1(80.23,16.54)
BOOT1: length 4.5
  Top Layer w0.152: RN3.2 81.06,17.24 81.39,16.91 83.01,16.91 83.35,16.57 U2.20
EXIT_RX: length 37.4
  Top Layer w0.152: U2.22 82.35,14.28 v1(82.04,13.97)
  Bottom Layer w0.152: H1.2 96.3,11.41 93.95,11.41 88.37,5.83 84.8,5.83 83.03,7.6 81.08,7.6 79.15,9.54 78.07,9.54 75.69,11.91 75.69,12.68 77.77,14.76 78.43,14.76 78.46,14.73 78.46,14.73 79.23,13.97 v1(82.04,13.97)
EXIT_TX: length 39.7
  Top Layer w0.152: U2.21 82.85,14.63 82.63,14.41 v1(82.63,13.33)
  Bottom Layer w0.152: v1(82.63,13.33) 79.5,13.33 78.36,14.48 78.35,14.48 78.33,14.5 77.88,14.5 77.86,14.48 77.85,14.48 75.95,12.57 75.95,12.02 78.17,9.79 79.25,9.79 81.19,7.85 83.13,7.85 84.9,6.08 88.26,6.08 93.84,11.67 95.53,11.67 96.39,12.53 96.39,14.05 H1.1
HALL_OUT: length 101.8
  Top Layer w0.254: v1(82.43,43.79) U9#3.2 81.59,44 82.3,44.71 82.3,49.67 76.77,55.2 49.1,55.2 47.4,53.49 R5#2.1 ; v1(10.3,86.52) U9#2.2 11.13,86.31 10.42,85.59 10.42,80.64 15.95,75.11 43.62,75.11 45.32,76.81 R5.1
  Bottom Layer w0.254: Hall#2.1 82.43,42.75 v1(82.43,43.79) ; v1(10.3,86.52) 10.3,87.56 Hall.1
HALL_RC: length 11.9
  Top Layer w0.152: C11.2 43.59,83.27 R5.2 47.52,85.47 48.41,85.47 U10.5 ; C11#2.2 49.13,47.04 R5#2.2 45.2,44.84 44.31,44.84 U10#2.5
IR1_RC: length 21.2
  Top Layer w0.152: U10.3 42.43,86.87 41.66,86.1 C12.2 42.36,82.55 45.76,82.55 46.27,83.06 46.76,83.06 R6.1 ; R6#2.1 45.96,47.25 46.45,47.25 46.96,47.76 50.36,47.76 C12#2.2 51.06,44.21 50.29,43.44 U10#2.3
IR1_RECV: length 22.8
  Top Layer w0.152: R6.2 47.3,82.09 47.79,82.09 48.27,82.57 48.27,82.92 R4.2 49.35,82.55 52.44,82.55 U7#2.3 ; U7#3.3 40.28,47.76 43.37,47.76 R4#2.2 44.45,47.39 44.45,47.74 44.93,48.22 45.42,48.22 R6#2.2
  Bottom Layer w0.152: U7#2.3 54.62,84.64 IR1#2.1 ; U7#3.3 38.1,45.67 IR1.1
K_ONLINE: length 107.1
  Top Layer w0.152: 48.01,41.79 48.01,41.28 48.39,40.9 U10#2.1 ; 48.01,41.79 47.12,42.68 v1(47.12,44.71) ; 48.01,41.79 48.39,42.17 U10#2.2 ; U10.1 44.33,89.41 44.71,89.02 44.71,88.52 ; U10.2 44.33,88.14 44.71,88.52 ; 44.71,88.52 45.6,87.63 v1(45.6,85.6)
  Top Layer w0.508: v1(13.34,57.05) v1(14.23,57.05) CN2#2.6 ; v1(79.38,73.25) v1(78.49,73.25) CN2.6
  Bottom Layer w0.254: v1(78.49,73.25) 75.98,75.77 75.98,80.39 74,82.37 49.59,82.37 46.36,85.6 v1(45.6,85.6) ; v1(47.12,44.71) 46.36,44.71 43.13,47.94 18.72,47.94 16.74,49.91 16.74,54.54 v1(14.23,57.05)
  Bottom Layer w0.508: v1(78.49,73.25) v1(79.38,73.25) 80.57,73.25 80.63,73.31 ; v1(14.23,57.05) v1(13.34,57.05) 12.14,57.05 12.09,57
K_ONLINE1: length 94.4
  Top Layer w0.152: v1(88.59,14.68) 88.82,14.44 89.12,14.44 89.33,14.23 89.33,13.76 89.14,13.58 U2.11 ; CN2#3.6 v1(11.72,25.53)
  Bottom Layer w0.152: v1(11.72,25.53) 12.26,24.99 13.94,24.99 15.88,26.93 87.61,26.93 88.59,25.96 88.59,14.68
K_ONLINE2: length 68.7
  Top Layer w0.152: U2.13 86.85,14.29 v1(87.09,14.05) ; CN3.6 v1(36.42,25.53)
  Bottom Layer w0.152: v1(36.42,25.53) 36.96,24.99 38.84,24.99 40.22,26.38 87.38,26.38 88.03,25.73 88.03,24.19 87.09,23.25 v1(87.09,14.05)
K_ONLINE3: length 45.2
  Top Layer w0.152: v1(85.94,12.92) 85.85,13.01 U2.15 ; CN4.6 v1(61.12,25.53)
  Bottom Layer w0.152: v1(61.12,25.53) 61.55,25.1 63.46,25.1 64.17,25.82 87.14,25.82 87.47,25.49 87.47,24.42 85.94,22.89 v1(85.94,12.92)
K_ONLINE4: length 17.8
  Top Layer w0.152: v1(84.46,13.45) 84.85,13.84 U2.17 ; v1(84.93,25.27) 85.82,24.38 CN5.6
  Bottom Layer w0.152: v1(84.46,13.45) 84.46,18.5 arc(84.51,18.62) 84.62,18.66 arc(84.74,18.71) 84.79,18.82 84.79,18.88 arc(84.74,19) 84.62,19.04 84.21,19.04 arc(84.02,19.23) 84.21,19.42 84.27,19.42 arc(84.41,19.48) 84.46,19.61 84.46,24.8 v1(84.93,25.27)
K_PULL: length 107.6
  Top Layer w0.152: 47,87.25 47,87.75 47.38,88.14 U10.7 ; 47,87.25 46.14,86.39 v1(46.14,84.99) ; 47,87.25 47.38,86.87 U10.6 ; U10#2.7 45.34,42.17 45.72,42.55 45.72,43.06 ; v1(46.58,45.32) 46.58,43.92 45.72,43.06 ; 45.72,43.06 45.34,43.44 U10#2.6
  Top Layer w0.508: CN2#2.5 v1(14.23,59.05) v1(13.34,59.05) ; CN2.5 v1(78.49,71.25) v1(79.38,71.25)
  Bottom Layer w0.254: v1(46.58,45.32) 43.6,48.29 18.86,48.29 17.09,50.06 17.09,56.18 v1(14.23,59.05) ; v1(78.49,71.25) 75.62,74.12 75.62,80.25 73.86,82.02 49.12,82.02 v1(46.14,84.99)
  Bottom Layer w0.508: Pressure#2.1 12.13,59.05 v1(13.34,59.05) v1(14.23,59.05) ; v1(78.49,71.25) v1(79.38,71.25) 80.59,71.25 Pressure.1
K_PULL1: length 93.6
  Top Layer w0.152: CN2#3.5 v1(13.72,25.53) ; U2.10 89.15,13.08 89.58,13.51 89.58,14.76 v1(89.31,15.03)
  Bottom Layer w0.152: v1(89.31,15.03) 89.28,15.03 88.89,15.42 88.89,19.06 arc(88.94,19.19) 89.08,19.25 89.17,19.25 arc(89.36,19.44) 89.17,19.63 89.08,19.63 arc(88.94,19.69) 88.89,19.82 88.89,26.08 87.78,27.19 15.39,27.19 v1(13.72,25.53)
K_PULL2: length 68.4
  Top Layer w0.152: U2.12 87.78,14.08 87.63,14.22 v1(87.63,14.73) ; CN3.5 v1(38.42,25.53)
  Bottom Layer w0.152: v1(87.63,14.73) 87.63,16.15 arc(87.69,16.28) 87.82,16.34 88.03,16.34 arc(88.22,16.53) 88.03,16.72 87.82,16.72 arc(87.63,16.91) 87.82,17.1 88.03,17.1 arc(88.22,17.29) 88.03,17.48 87.82,17.48 arc(87.63,17.67) 87.82,17.86 88.03,17.86 arc(88.22,18.05) 88.03,18.24 87.82,18.24 arc(87.69,18.3) 87.63,18.43 87.63,23.36 88.33,24.06 88.33,25.85 87.5,26.68 39.58,26.68 v1(38.42,25.53)
K_PULL3: length 44.9
  Top Layer w0.152: U2.14 86.35,13.72 v1(86.73,13.33) ; 63.12,23.29 v1(63.12,25.64)
  Bottom Layer w0.152: v1(63.12,25.64) 63.61,26.12 87.27,26.12 87.77,25.62 87.77,24.29 86.56,23.08 86.56,19.19 arc(86.59,19.11) 86.68,19.07 arc(86.77,19.03) 86.81,18.95 86.81,18.81 arc(86.77,18.73) 86.68,18.69 86.43,18.69 arc(86.35,18.65) 86.31,18.57 86.31,18.43 arc(86.35,18.34) 86.43,18.31 86.68,18.31 arc(86.77,18.27) 86.81,18.18 86.81,18.05 arc(86.77,17.96) 86.68,17.93 86.43,17.93 arc(86.35,17.89) 86.31,17.8 86.31,17.67 arc(86.35,17.58) 86.43,17.55 86.68,17.55 arc(86.77,17.51) 86.81,17.42 86.81,17.29 arc(86.77,17.2) 86.68,17.17 86.43,17.17 arc(86.35,17.13) 86.31,17.04 86.31,16.91 arc(86.35,16.82) 86.43,16.78 arc(86.52,16.75) 86.56,16.66 86.56,13.51 v1(86.73,13.33)
K_PULL4: length 18.3
  Top Layer w0.152: v1(86.93,25.27) 87.82,24.38 CN5.5 ; U2.16 85.35,13.21 v1(85.09,12.95)
  Bottom Layer w0.152: v1(86.93,25.27) 85.09,23.43 v1(85.09,12.95)
MCU_RTS: length 26.9
  Top Layer w0.152: U7.3 62.96,4.54 62.87,4.44 62.87,3.42 63.02,3.27 ; U2.33 79.81,10.03 78.1,10.03 77.65,9.58 75.11,9.58 73.28,7.75 73.28,6.1 70.87,3.68 67.25,3.68 65.02,1.46 63.31,1.46 62.87,1.91 62.87,3.12 63.02,3.27 ; 63.02,3.27 U7.2
MCU_RX: length 54.4
  Top Layer w0.152: 75.99,10.41 75.58,10.41 73.03,7.85 73.03,6.2 70.76,3.94 66.8,3.94 64.87,2 U7.1 ; 75.99,10.41 77.31,10.41 78.02,11.11 79.82,11.11 U2.31 82.07,11.08 83.16,12.17 83.16,14.19 v1(83.32,14.34) ; 75.99,10.41 v1(75.99,10.11) ; RN3.3 81.86,17.48 82.07,17.27 83.52,17.27 v1(83.67,17.12)
  Bottom Layer w0.152: v1(83.32,14.34) 83.67,14.7 v1(83.67,17.12) ; v1(75.99,10.11) 76.23,10.11 77.31,9.03 78.94,9.03 80.87,7.09 82.82,7.09 84.59,5.32 88.58,5.32 90.92,7.67 H2.4
MCU_SCL: length 82.4
  Top Layer w0.152: R3.2 70.1,85.98 v1(68.84,85.98) 67.37,85.98 U1.7 ; R3#2.2 22.62,44.33 v1(23.88,44.33) 25.35,44.33 U1#2.7
  Top Layer w0.508: CN2#2.1 v1(14.23,67.05) v1(13.34,67.05) ; v1(79.38,63.25) v1(78.49,63.25) CN2.1
  Bottom Layer w0.152: 79.39,63.25 83.32,67.18 83.32,74.14 81.01,76.45 78.46,76.45 77.6,77.31 77.6,80.9 72.53,85.98 v1(68.84,85.98) ; 13.33,67.05 9.4,63.13 9.4,56.16 11.71,53.86 14.26,53.86 15.12,53 15.12,49.41 20.2,44.33 v1(23.88,44.33)
  Bottom Layer w0.508: v1(14.23,67.05) v1(13.34,67.05) ; v1(78.49,63.25) v1(79.38,63.25)
MCU_SCL1: length 128
  Top Layer w0.152: U2.25 78.21,14.08 v1(78.1,13.97) ; v1(21.69,27.98) 21.69,23.22 CN2#3.1 ; 84.29,18.17 84.29,17.44 85.17,16.56 87.27,16.56 88.2,15.62 91.52,15.62 92.03,15.11 92.67,15.11 v5(92.77,15.21)
  Bottom Layer w0.152: v1(78.1,13.97) 77.89,13.97 77.08,13.16 77.08,12.01 77.93,11.16 82.39,11.16 85.68,7.86 87.52,7.86 92.26,12.6 92.26,14.7 v5(92.77,15.21) 92.99,15.44 92.99,23.97 94.03,25 94.03,26.59 91.86,28.76 72.01,28.76 71.45,29.32 68.84,29.32 67.77,28.26 47.07,28.26 46.52,28.81 43.97,28.81 42.91,27.75 27.46,27.75 26.7,28.51 22.23,28.51 v1(21.69,27.98)
MCU_SCL2: length 99.1
  Top Layer w0.152: v1(77.86,13.18) 78.07,13.18 78.47,13.58 U2.26 ; v1(46.3,28.28) 46.42,28.15 CN3.1 ; RN2.2 85.09,17.4 85.68,16.81 87.37,16.81 88.31,15.87 91.94,15.87 v5(92.22,15.59)
  Bottom Layer w0.152: v1(46.3,28.28) 46.57,28 67.88,28 68.95,29.07 71.34,29.07 71.9,28.51 91.75,28.51 93.77,26.49 93.77,25.11 92.74,24.07 92.74,16.1 v5(92.22,15.59) 92,15.36 92,12.7 87.42,8.12 85.78,8.12 82.49,11.41 78.04,11.41 77.33,12.12 77.33,12.66 v1(77.86,13.18)
MCU_SCL3: length 70.4
  Top Layer w0.152: v5(92.26,16.3) 92.09,16.13 88.41,16.13 87.48,17.06 86.19,17.06 85.89,17.36 RN2.3 ; CN4.1 v1(71.12,28.53) ; v1(77.86,12.34) 78.6,13.08 U2.27
  Bottom Layer w0.152: v1(71.12,28.53) 71.4,28.26 91.65,28.26 93.52,26.38 93.52,25.21 92.48,24.18 92.48,16.52 v5(92.26,16.3) 91.75,15.79 91.75,12.81 87.31,8.37 85.89,8.37 82.6,11.66 78.54,11.66 78.41,11.79 78.41,11.79 78.09,12.1 78.09,12.11 v1(77.86,12.34)
MCU_SCL4: length 42.5
  Top Layer w0.152: CN5.1 95.82,24.45 94.11,26.16 v1(92.99,26.16) ; v1(78.63,12.32) 78.88,12.58 U2.28 ; RN2.4 86.69,17.45 86.82,17.32 87.58,17.32 88.51,16.39 91.43,16.39 v5(91.72,16.68)
  Bottom Layer w0.152: v1(92.99,26.16) 92.99,25.04 92.23,24.28 92.23,17.19 v5(91.72,16.68) 91.49,16.45 91.49,12.91 87.21,8.63 85.99,8.63 82.3,12.32 v1(78.63,12.32)
MCU_SDA: length 82.7
  Top Layer w0.152: U1#2.6 25.37,45.73 v1(23.88,45.73) 22.87,45.73 R2#2.2 ; R2.2 69.85,84.58 v1(68.84,84.58) 67.35,84.58 U1.6
  Top Layer w0.508: CN2.2 v1(78.49,65.25) v1(79.38,65.25) ; v1(13.34,65.05) v1(14.23,65.05) CN2#2.2
  Bottom Layer w0.152: v1(68.84,84.58) 71.24,84.58 arc(71.38,84.64) 71.43,84.77 71.43,85.06 arc(71.62,85.25) 71.81,85.06 71.81,84.77 arc(72,84.58) 72.2,84.77 72.2,85.06 arc(72.39,85.25) 72.58,85.06 72.58,84.77 arc(72.63,84.64) 72.77,84.58 73.56,84.58 77.35,80.79 77.35,77.2 78.35,76.2 80.91,76.2 83.07,74.04 83.07,67.31 81.01,65.25 v1(79.38,65.25) ; v1(23.88,45.73) 21.48,45.73 arc(21.34,45.67) 21.29,45.54 21.29,45.24 arc(21.1,45.05) 20.91,45.24 20.91,45.54 arc(20.71,45.73) 20.52,45.54 20.52,45.24 arc(20.33,45.05) 20.14,45.24 20.14,45.54 arc(20.09,45.67) 19.95,45.73 19.16,45.73 15.37,49.52 15.37,53.11 14.37,54.11 11.81,54.11 9.65,56.27 9.65,63 11.71,65.05 v1(13.34,65.05)
  Bottom Layer w0.508: v1(14.23,65.05) v1(13.34,65.05) ; v1(78.49,65.25) v1(79.38,65.25)
MCU_SDA1: length 118.7
  Top Layer w0.152: U2.2 86.94,9.08 v1(86.86,9.16) ; v1(19.6,27.77) 19.6,26.99 arc(19.54,26.86) 19.41,26.8 18.46,26.8 arc(18.27,26.61) 18.46,26.42 20.73,26.42 arc(20.92,26.23) 20.73,26.04 18.46,26.04 arc(18.27,25.85) 18.46,25.66 20.73,25.66 arc(20.92,25.47) 20.73,25.28 19.79,25.28 arc(19.65,25.22) 19.6,25.09 19.6,23.31 CN2#3.2 ; 90.79,18.17 90.87,18.09 v5(91.68,18.09)
  Bottom Layer w0.152: v1(86.86,9.16) 87.38,9.16 91.24,13.02 91.24,16.87 91.68,17.32 v5(91.68,18.09) 91.68,25.09 92.45,25.86 92.45,26.72 91.17,28 70.01,28 69.45,28.56 68.8,28.56 67.99,27.75 45.44,27.75 44.89,28.3 43.93,28.3 43.06,27.44 26.89,27.44 arc(26.75,27.5) 26.7,27.63 26.7,28 arc(26.51,28.19) 26.32,28 26.32,27.63 arc(26.13,27.44) 25.94,27.63 25.94,28 arc(25.75,28.19) 25.56,28 25.56,27.63 arc(25.37,27.44) 25.17,27.63 25.17,28 arc(24.98,28.19) 24.79,28 24.79,27.63 arc(24.6,27.44) 24.41,27.63 24.41,28 arc(24.22,28.19) 24.03,28 24.03,27.63 arc(23.84,27.44) 23.65,27.63 23.65,28 arc(23.46,28.19) 23.27,28 23.27,27.63 arc(23.08,27.44) 22.89,27.63 22.89,28 arc(22.7,28.19) 22.51,28 22.51,27.63 arc(22.45,27.5) 22.32,27.44 19.92,27.44 v1(19.6,27.77)
MCU_SDA2: length 92.1
  Top Layer w0.152: v1(44.67,27.77) 44.67,27.36 arc(44.61,27.23) 44.48,27.17 43.17,27.17 arc(42.98,26.98) 43.17,26.79 45.93,26.79 arc(46.12,26.6) 45.93,26.41 43.17,26.41 arc(42.98,26.22) 43.17,26.03 45.93,26.03 arc(46.12,25.84) 45.93,25.65 43.17,25.65 arc(42.98,25.45) 43.17,25.26 44.48,25.26 arc(44.61,25.21) 44.67,25.07 44.67,23.43 CN3.2 ; v5(90.81,17.12) 90.59,17.34 90.1,17.34 89.99,17.45 RN1.3 ; U2.3 87.2,9.58 v1(86.79,9.98)
  Bottom Layer w0.152: v1(86.79,9.98) 87.84,9.98 90.81,12.95 v5(90.81,17.12) 90.81,23.4 arc(90.87,23.53) 91,23.59 91.24,23.59 arc(91.43,23.78) 91.24,23.97 91,23.97 arc(90.87,24.03) 90.81,24.16 90.81,24.58 92.2,25.96 92.2,26.61 91.07,27.75 69.9,27.75 69.34,28.3 68.9,28.3 68.09,27.49 44.95,27.49 v1(44.67,27.77)
MCU_SDA3: length 64.5
  Top Layer w0.152: U2.4 87.46,10.08 86.89,10.64 v1(86.37,10.64) ; CN4.2 69.12,25.09 arc(69.07,25.22) 68.93,25.28 67.89,25.28 arc(67.7,25.47) 67.89,25.66 70.36,25.66 arc(70.55,25.85) 70.36,26.04 67.89,26.04 arc(67.7,26.23) 67.89,26.42 70.36,26.42 arc(70.55,26.61) 70.36,26.8 67.89,26.8 arc(67.7,26.99) 67.89,27.19 68.93,27.19 arc(69.07,27.24) 69.12,27.38 v1(69.12,27.77) ; v5(90.16,16.87) 90.14,16.87 89.66,17.34 89.34,17.34 89.19,17.49 RN1.2
  Bottom Layer w0.152: v1(69.12,27.77) 69.4,27.49 90.96,27.49 91.94,26.51 91.94,26.07 90.16,24.29 v5(90.16,16.87) 90.16,12.66 88.14,10.64 v1(86.37,10.64)
MCU_SDA4: length 38.2
  Top Layer w0.152: U2.5 87.34,10.58 86.51,11.41 v1(86.06,11.41) ; CN5.2 93.82,24.41 91.95,26.29 v1(91.41,26.29) ; RN1.1 88.54,18.02 88.54,17.25 88.92,16.87 v5(89.46,16.87)
  Bottom Layer w0.152: v1(91.41,26.29) 91.41,26.26 91.15,26 arc(91.01,25.94) 90.88,26 90.24,26.63 arc(89.97,26.64) 89.97,26.37 90.61,25.73 arc(90.61,25.46) 90.34,25.46 89.71,26.1 arc(89.44,26.1) 89.44,25.83 90.07,25.19 arc(90.13,25.06) 90.07,24.92 89.79,24.64 89.79,24.55 arc(89.73,24.42) 89.6,24.36 89.33,24.36 arc(89.14,24.17) 89.33,23.98 89.6,23.98 arc(89.79,23.79) 89.6,23.6 89.33,23.6 arc(89.14,23.41) 89.33,23.22 89.6,23.22 arc(89.79,23.03) 89.6,22.84 89.33,22.84 arc(89.14,22.65) 89.33,22.46 89.6,22.46 arc(89.79,22.27) 89.6,22.08 89.33,22.08 arc(89.14,21.89) 89.33,21.69 89.6,21.69 arc(89.79,21.5) 89.6,21.31 89.33,21.31 arc(89.14,21.12) 89.33,20.93 89.6,20.93 arc(89.79,20.74) 89.6,20.55 89.33,20.55 arc(89.14,20.36) 89.33,20.17 89.6,20.17 arc(89.73,20.12) 89.79,19.98 89.79,19.05 89.46,18.72 v5(89.46,16.87) 89.46,15.82 89.84,15.44 89.84,12.7 88.54,11.41 v1(86.06,11.41)
MCU_TX: length 44.4
  Top Layer w0.152: v1(75.72,11.13) 75.72,10.66 75.73,10.66 ; 75.73,10.66 77.21,10.66 77.96,11.41 78.91,11.41 79.08,11.58 U2.30 ; 75.73,10.66 75.47,10.66 72.77,7.96 72.77,6.31 70.65,4.19 66.55,4.19 64.93,5.81 U7.4
  Bottom Layer w0.152: H2.3 93.1,10.21 88.47,5.58 84.69,5.58 82.92,7.34 80.98,7.34 79.04,9.28 77.57,9.28 v1(75.72,11.13)
MOTOR1_H: length 67.6
  Top Layer w0.152: U8.3 18.52,8.79 18.85,8.45 v1(18.85,8.18) ; v1(81.6,5.84) 81.85,6.1 U2.38
  Bottom Layer w0.152: v1(81.6,5.84) 80.61,5.84 77.68,8.77 73.35,8.77 72.17,9.96 42.32,9.96 41.76,9.4 20.07,9.4 v1(18.85,8.18)
MOTOR1_HOUT: length 19.8
  Top Layer w0.508: 18.52,14.88 18.52,15.77 17.53,16.76 17.53,19.56 17.02,20.07 6.45,20.07 5.72,20.79 CN2#3.9
MOTOR1_L: length 70.8
  Top Layer w0.152: v1(18.03,7.62) 17.4,7.62 17.25,7.77 U8.2 ; v1(82.1,5.27) 82.35,5.52 U2.39
  Bottom Layer w0.152: v1(82.1,5.27) 80.82,5.27 77.58,8.52 73.25,8.52 72.06,9.71 42.43,9.71 41.87,9.14 20.57,9.14 19.05,7.62 v1(18.03,7.62)
MOTOR1_LOUT: length 17.5
  Top Layer w0.508: 15.98,14.88 15.98,15.52 15.11,16.38 15.11,17.65 13.31,19.46 6.2,19.46 3.72,21.93 CN2#3.10
MOTOR2_H: length 61.7
  Top Layer w0.152: U2.40 82.85,4.94 v1(82.64,4.73) ; v1(26.98,8.05) 26.98,8.86 U9.3
  Bottom Layer w0.152: v1(82.64,4.73) 81,4.73 77.47,8.26 73.14,8.26 71.96,9.45 42.54,9.45 41.92,8.84 27.77,8.84 v1(26.98,8.05)
MOTOR2_HOUT: length 12.1
  Top Layer w0.508: CN3.9 30.42,21.79 28.96,20.32 26.29,20.32 25.91,19.94 25.91,16.51 26.77,15.64 U9.6
MOTOR2_L: length 64.8
  Top Layer w0.152: U9.2 25.5,7.77 25.65,7.62 v1(26.29,7.62) ; U2.41 83.35,4.36 v1(83.18,4.19)
  Bottom Layer w0.152: v1(26.29,7.62) 26.39,7.52 27.2,7.52 28.27,8.58 42.03,8.58 42.64,9.2 71.85,9.2 73.04,8.01 77.37,8.01 81.18,4.19 v1(83.18,4.19)
MOTOR2_LOUT: length 12.4
  Top Layer w0.508: U9.8 24.23,15.39 23.55,16.08 23.55,19.86 24.61,20.93 27.66,20.93 28.42,21.69 CN3.10
MOTOR3_H: length 55.7
  Top Layer w0.152: U10#3.3 35.11,8.86 v1(35.11,8.05) ; U2.42 83.85,3.79 v1(83.72,3.66)
  Bottom Layer w0.152: v1(35.11,8.05) 41.85,8.05 42.75,8.94 71.74,8.94 72.93,7.75 77.26,7.75 81.36,3.66 v1(83.72,3.66)
MOTOR3_HOUT: length 26.9
  Top Layer w0.508: v2(34.16,17.33) 34.24,17.25 34.24,15.8 34.9,15.14 U10#3.6 ; v2(50.04,20.45) 53.72,20.45 55.12,21.85 CN4.9
  Bottom Layer w0.508: v2(34.16,17.33) 37.28,20.45 v2(50.04,20.45)
MOTOR3_L: length 58.8
  Top Layer w0.152: U2.43 84.35,3.2 v1(84.23,3.08) ; U10#3.2 33.63,7.77 33.82,7.58 v1(34.5,7.58)
  Bottom Layer w0.152: v1(34.5,7.58) 34.56,7.52 41.68,7.52 42.85,8.69 71.64,8.69 72.83,7.5 77.16,7.5 81.57,3.08 v1(84.23,3.08)
MOTOR3_LOUT: length 26.8
  Top Layer w0.508: v2(31.5,16) 32.36,15.14 U10#3.8 ; CN4.10 53.12,22.01 52.45,21.34 v2(49.15,21.34)
  Bottom Layer w0.508: v2(31.5,16) 31.61,16 36.67,21.06 48.87,21.06 v2(49.15,21.34)
MOTOR4_H: length 49.9
  Top Layer w0.152: U11.3 43.24,8.85 v1(43.24,8.05) ; U2.45 85.38,7.04 v1(85.38,3.96)
  Bottom Layer w0.152: v1(43.24,8.05) 43.62,8.43 71.53,8.43 72.72,7.25 77.05,7.25 81.75,2.55 84.58,2.55 85.38,3.36 v1(85.38,3.96)
MOTOR4_HOUT: length 43.3
  Top Layer w0.508: CN5.9 79.82,21.91 78.49,20.57 74.37,20.57 v2(73.7,19.9) ; v2(42.29,17.02) 42.29,15.88 43.03,15.14 U11.6
  Bottom Layer w0.508: v2(73.7,19.9) 52.03,19.9 51.05,18.92 44.2,18.92 v2(42.29,17.02)
